# Altium project JEAC605UM-FTTSC-2.0.PRJPCB (part 2 of 3)

## Sheet CPU2.schdoc
size C; SheetNumber: 2; SheetTotal: 8
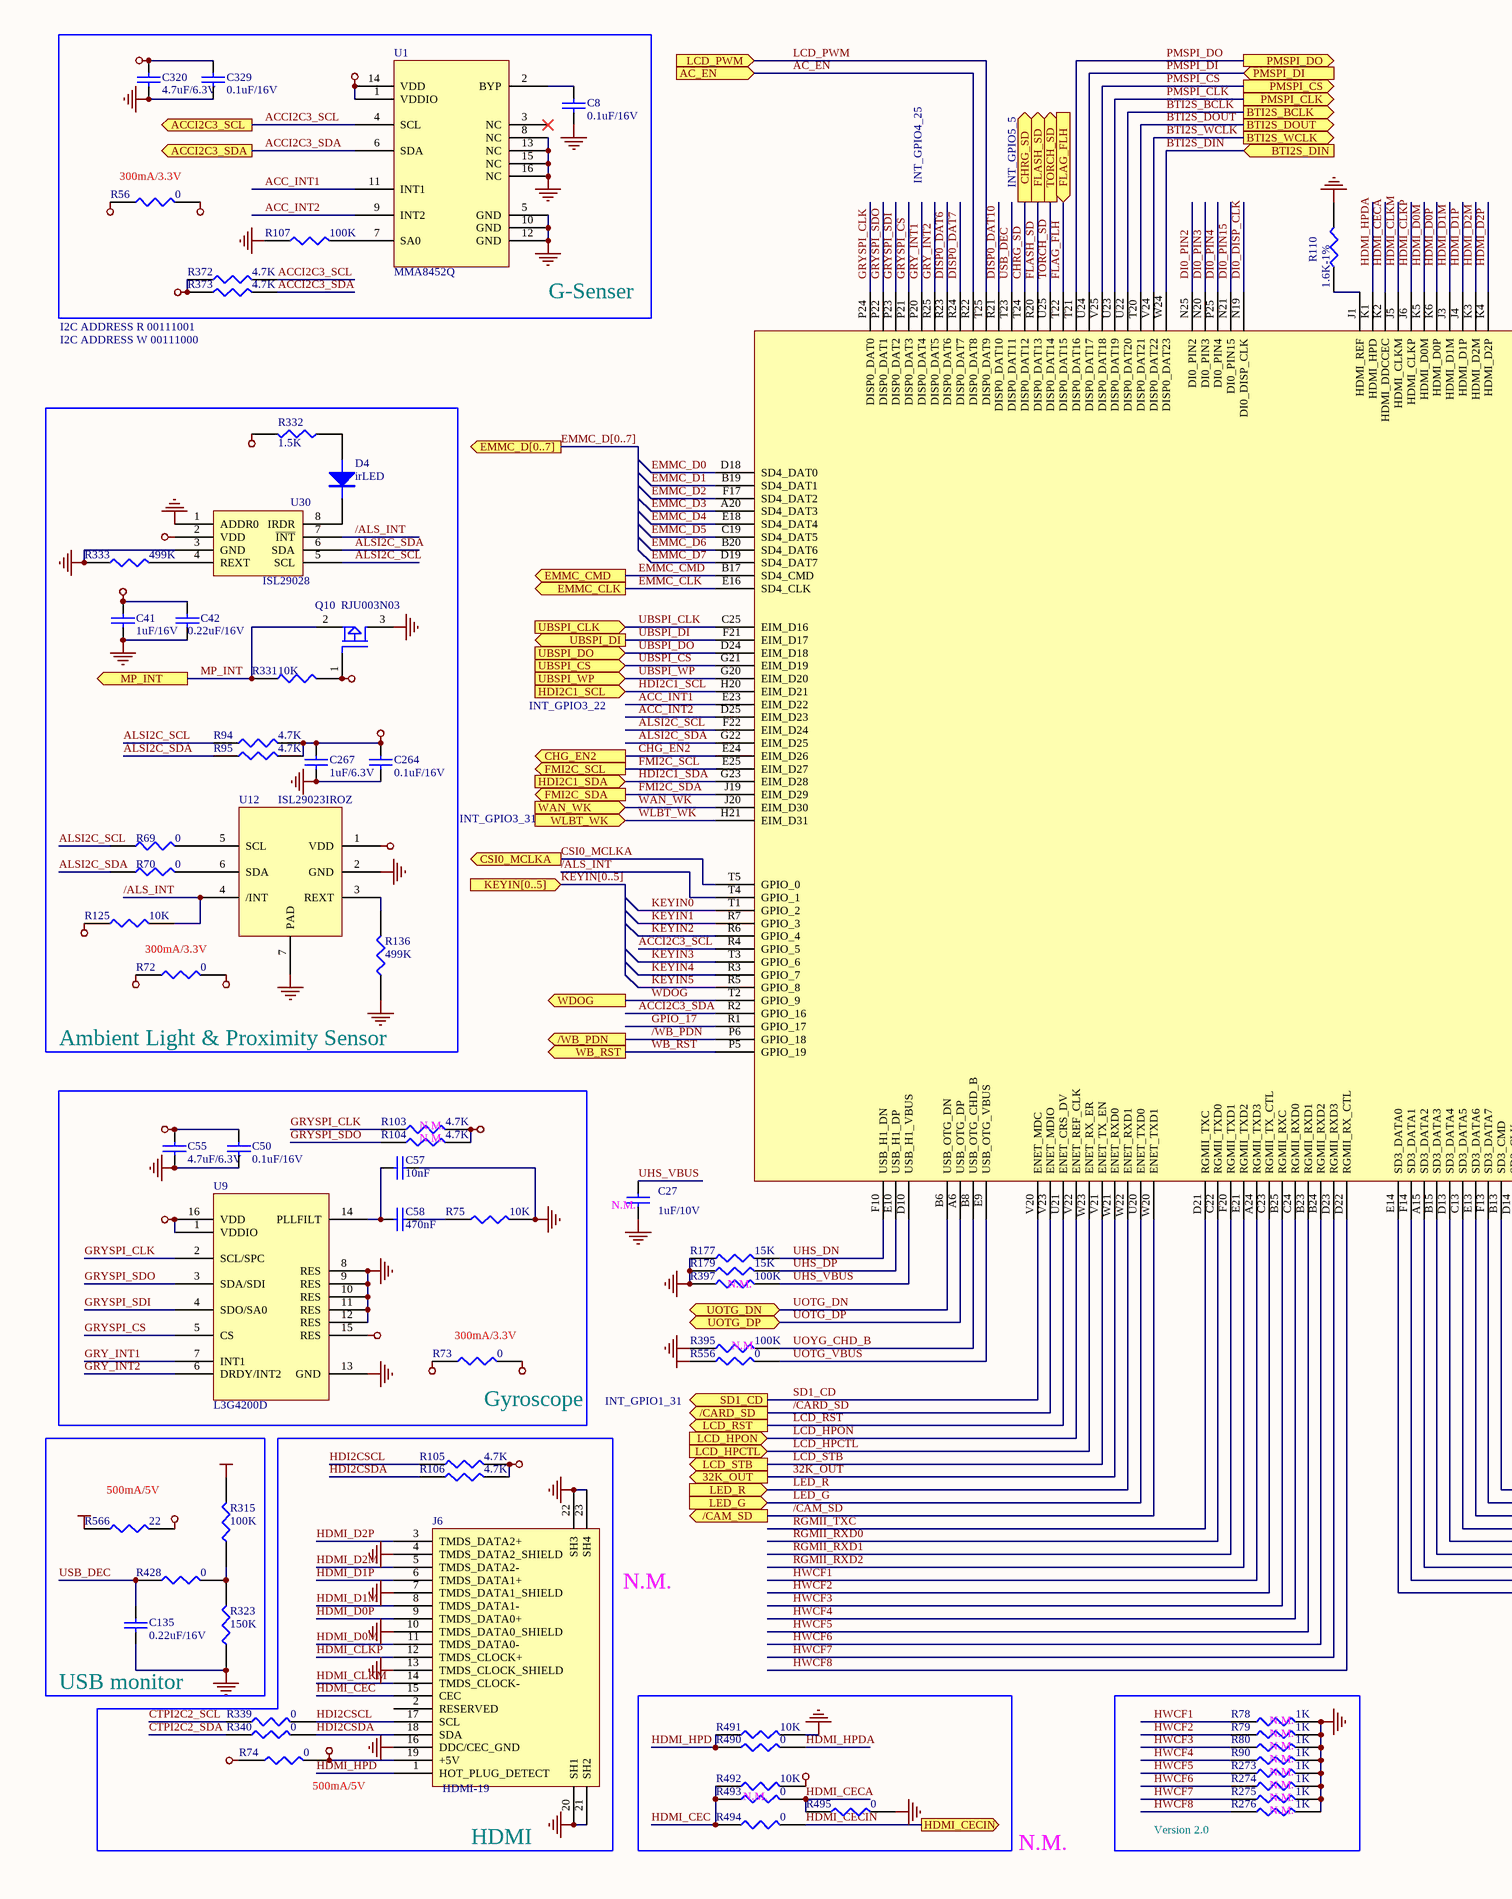
[diagram p7: CPU2.schdoc, left]
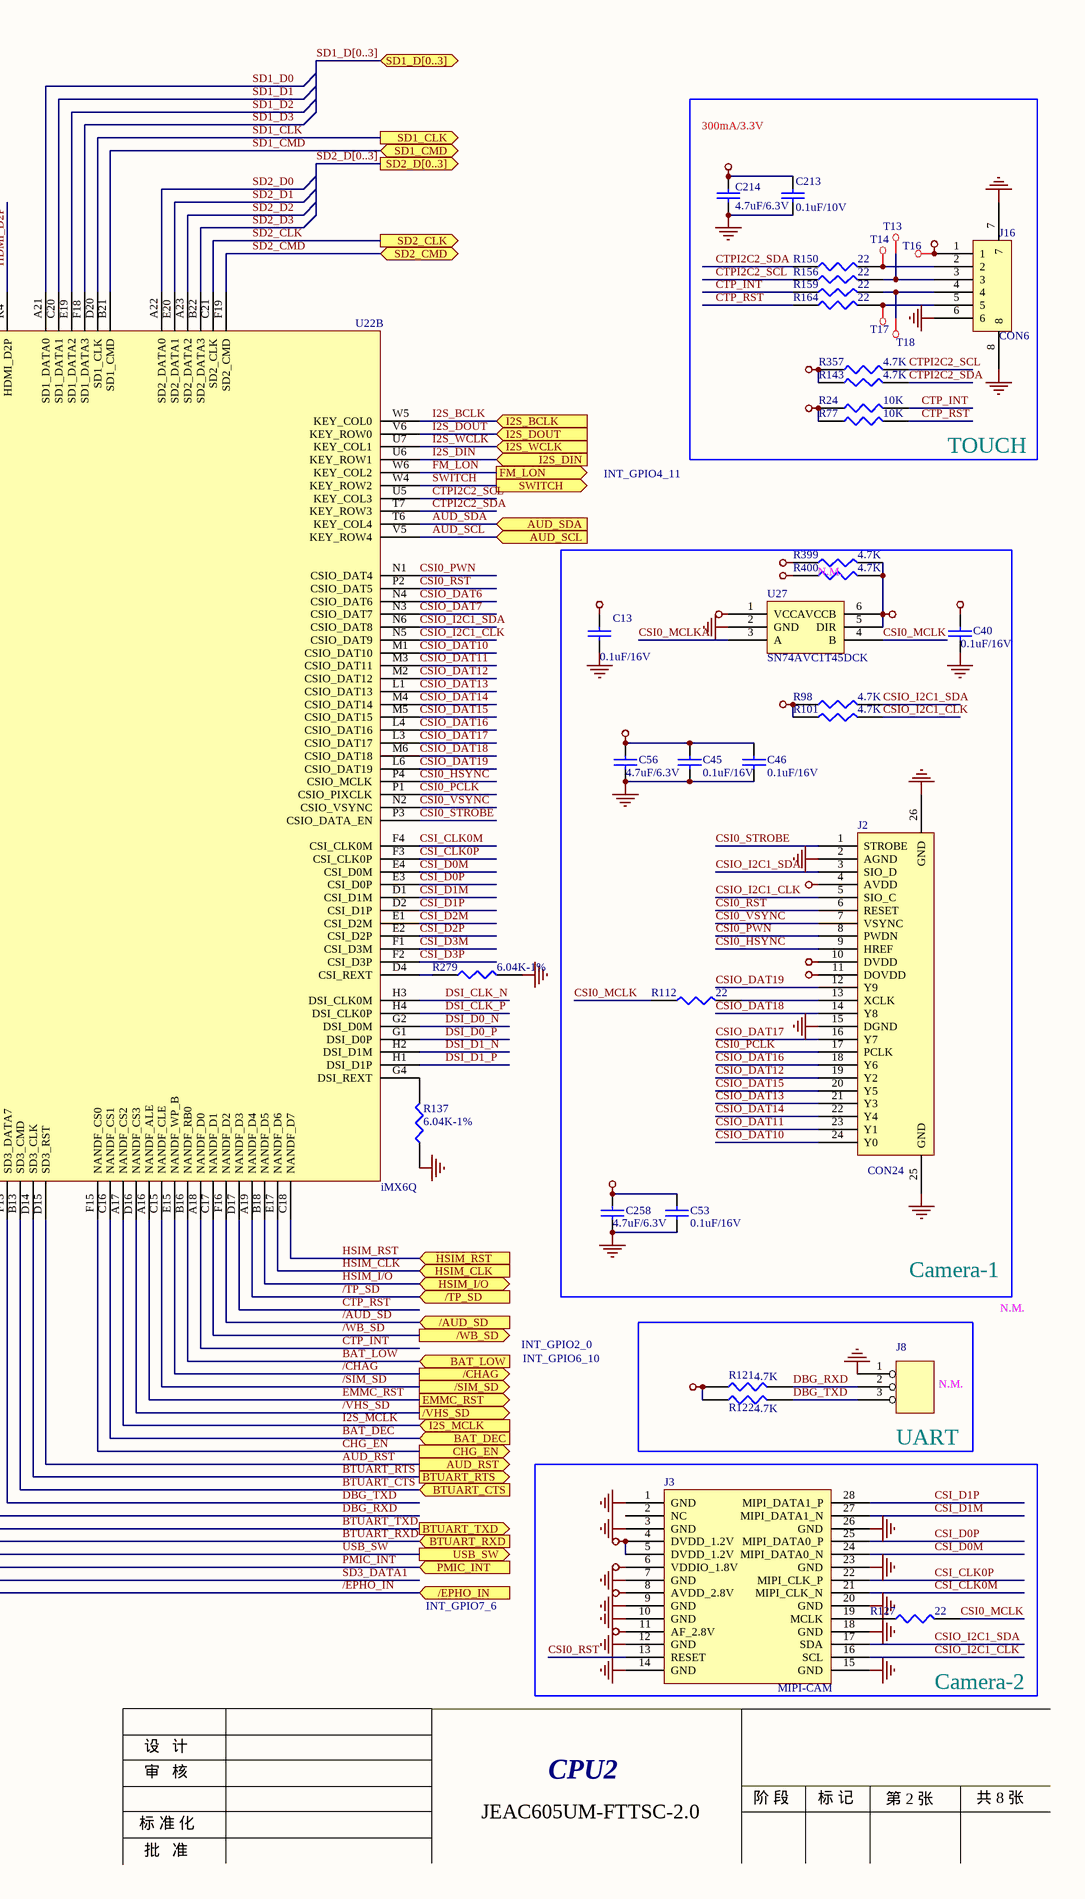
[diagram p8: CPU2.schdoc, right]

### Parts
C8  0.1uF/16V  [C0402]
C13  0.1uF/16V  [C0402]
C27  1uF/10V  [C0603]
C40  0.1uF/16V  [C0402]
C41  1uF/16V  [C0402]
C42  0.22uF/16V  [C0402]
C45  0.1uF/16V  [C0402]
C46  0.1uF/16V  [C0402]
C50  0.1uF/16V  [C0402]
C53  0.1uF/16V  [C0402]
C55  4.7uF/6.3V  [C0603]
C56  4.7uF/6.3V  [C0603]
C57  10nF  [C0402]
C58  470nF  [C0402]
C135  0.22uF/16V  [C0402]
C213  0.1uF/10V  [C0402]
C214  4.7uF/6.3V  [C0603]
C258  4.7uF/6.3V  [C0603]
C264  0.1uF/16V  [C0402]
C267  1uF/6.3V  [C0402]
C320  4.7uF/6.3V  [C0603]
C329  0.1uF/16V  [C0402]
D4  irLED  [R0603]
J2  CON24  [J-CON-24-0_5]
J3  MIPI-CAM  [j-con-GB042-28P-H10-0_4]
J6  HDMI-19  [j-con-19-0_4]
J8  (no value)  [J-CON-3-2_1]
J16  CON6  [J-CON-6-0_5-ATOM]
Q10  RJU003N03  [SOT-23]
R24  10K  [R0402]
R56  0  [R0402]
R69  0  [R0402]
R70  0  [R0402]
R72  0  [R0402]
R73  0  [R0402]
R74  0  [R0603]
R75  10K  [R0402]
R77  10K  [R0402]
R78  1K  [R0402]
R79  1K  [R0402]
R80  1K  [R0402]
R90  1K  [R0402]
R94  4.7K  [R0402]
R95  4.7K  [R0402]
R98  4.7K  [R0402]
R101  4.7K  [R0402]
R103  4.7K  [R0402]
R104  4.7K  [R0402]
R105  4.7K  [R0402]
R106  4.7K  [R0402]
R107  100K  [R0402]
R110  1.6K-1%  [R0402]
R112  22  [R0402]
R121  4.7K  [R0402]
R122  4.7K  [R0402]
R125  10K  [R0402]
R127  22  [R0402]
R136  499K  [R0402]
R137  6.04K-1%  [R0402]
R143  4.7K  [R0402]
R150  22  [R0402]
R156  22  [R0402]
R159  22  [R0402]
R164  22  [R0402]
R177  15K  [R0402]
R179  15K  [R0402]
R273  1K  [R0402]
R274  1K  [R0402]
R275  1K  [R0402]
R276  1K  [R0402]
R279  6.04K-1%  [R0402]
R315  100K  [R0402]
R323  150K  [R0402]
R331  10K  [R0402]
R332  1.5K  [R0402]
R333  499K  [R0402]
R339  0  [R0402]
R340  0  [R0402]
R357  4.7K  [R0402]
R372  4.7K  [R0402]
R373  4.7K  [R0402]
R395  100K  [R0402]
R397  100K  [R0402]
R399  4.7K  [R0402]
R400  4.7K  [R0402]
R428  0  [R0402]
R490  0  [R0402]
R491  10K  [R0402]
R492  10K  [R0402]
R493  0  [R0402]
R494  0  [R0402]
R495  0  [R0402]
R556  0  [R0402]
R566  22  [R0402]
T13  Testpoint  [TP2_0]  (value not drawn)
T14  Testpoint  [TP2_0]  (value not drawn)
T16  Testpoint  [TP2_0]  (value not drawn)
T17  Testpoint  [TP2_0]  (value not drawn)
T18  Testpoint  [TP2_0]  (value not drawn)
U1  MMA8452Q  [U-DFN-16-0_5]
U9  L3G4200D  [U-LGA-16-0_65]
U12  ISL29023IROZ  [U-ODFN-6-0_65]
U22  iMX6Q  [U-BGA-624-0_8]  (part B of 3)
U27  SN74AVC1T45DCK  [SOT-363-6-0_65]
U30  ISL29028  [U-ODFN-8-0_5]

### Blocks framed on the sheet
G-Senser: C8 C320 C329 R56 R107 R372 R373 U1
TOUCH: C213 C214 J16 R24 R77 R143 R150 R156 R159 R164 R357 T13 T14 T16-T18
Ambient Light & Proximity Sensor: C41 C42 C264 C267 D4 Q10 R69 R70 R72 R94 R95 R125 R136 R331-R333 U12 U30
Camera-1: C13 C40 C45 C46 C53 C56 C258 J2 R98 R101 R112 R399 R400 U27
Gyroscope: C50 C55 C57 C58 R73 R75 R103 R104 U9
UART: J8 R121 R122
USB monitor: C135 R315 R323 R428 R566
HDMI: J6 R74 R105 R106 R339 R340
Camera-2: J3 R127
N.M.: R490-R495

### Ports
32K_OUT (out), /AUD_SD (in), /CAM_SD (out), /CARD_SD (out), /CHAG (out), /EPHO_IN (in), /SIM_SD (out), /TP_SD (in), /VHS_SD (out), /WB_PDN (out), /WB_SD (out), AC_EN (in), ACCI2C3_SCL (out), ACCI2C3_SDA (out), AUD_RST (out), AUD_SCL (in), AUD_SDA (in), BAT_DEC (in), BAT_LOW (in), BTI2S_BCLK (out), BTI2S_DIN (in), BTI2S_DOUT (out), BTI2S_WCLK (out), BTUART_CTS (in), BTUART_RTS (out), BTUART_RXD (in), BTUART_TXD (out), CHG_EN2 (out), CHG_EN (out), CHRG_SD (out), CSI0_MCLKA (out), EMMC_CLK (out), EMMC_CMD (out), EMMC_D[0..7] (out), EMMC_RST (out), FLAG_FLH (in), FLASH_SD (out), FM_LON (out), FMI2C_SCL (out), FMI2C_SDA (out), HDI2C1_SCL (in), HDI2C1_SDA (in), HDMI_CECIN (out), HSIM_CLK (in), HSIM_I/O (bidir), HSIM_RST (in), I2S_BCLK (in), I2S_DIN (in), I2S_DOUT (in), I2S_MCLK (in), I2S_WCLK (in), KEYIN[0..5] (in), LCD_HPCTL (in), LCD_HPON (in), LCD_PWM (in), LCD_RST (out), LCD_STB (out), LED_G (in), LED_R (in), MP_INT (out), PMIC_INT (in), PMSPI_CLK (out), PMSPI_CS (out), PMSPI_DI (in), PMSPI_DO (out), SD1_CD (out), SD1_CLK (out), SD1_CMD (bidir), SD1_D[0..3] (bidir), SD2_CLK (out), SD2_CMD (bidir), SD2_D[0..3] (out), SWITCH (out), TORCH_SD (out), UBSPI_CLK (in), UBSPI_CS (in), UBSPI_DI (out), UBSPI_DO (in), UBSPI_WP (in), UOTG_DN (bidir), UOTG_DP (bidir), USB_SW (out), WAN_WK (in), WB_RST (out), WDOG (out), WLBT_WK (in)

### Nets
GND: C8.1 C13.2 C27.2 C40.2 C41.2 C42.2 C45.2 C46.2 C50.1 C53.2 C55.1 C56.1 C57.1 C135.2 C213.2 C214.2 C258.1 C264.1 C267.1 C320.1 C329.1 J2.2(AGND) J2.15(DGND) J2.25(GND) J2.26(GND) J3.1(GND) J3.3(GND) J3.7(GND) J3.9(GND) J3.10(GND) J3.12(GND) J3.14(GND) J3.15(GND) J3.18(GND) J3.20(GND) J3.23(GND) J3.26(GND) J6.4(TMDS_DATA2_SHIELD) J6.7(TMDS_DATA1_SHIELD) J6.10(TMDS_DATA0_SHIELD) J6.13(TMDS_CLOCK_SHIELD) J6.16(DDC/CEC_GND) J6.20(SH1) J6.21(SH2) J6.22(SH3) J6.23(SH4) J8.1 J16.6 J16.7 J16.8 Q10.3(D) R75.2 R78.2 R79.2 R80.2 R90.2 R107.1 R110.2 R136.1 R137.1 R177.1 R179.1 R273.2 R274.2 R275.2 R276.2 R279.2 R323.1 R333.1 R395.1 R397.1 R491.2 R495.2 U1.5(GND) U1.8(NC) U1.10(GND) U1.12(GND) U1.13(NC) U1.15(NC) U1.16(NC) U9.8(RES) U9.9(RES) U9.10(RES) U9.11(RES) U9.12(RES) U9.13(GND) U12.2(GND) U12.7(PAD) U27.2(GND) U30.1(ADDR0) U30.3(GND)
USB_BUSIN: R315.2 R556.1 R566.1
VBUS: R74.1 R566.2
VCC_3V: C13.1 R121.1 R122.1 U27.1(VCCA)
VCC_ACC: C320.2 C329.2 R56.2 R372.1 R373.1 U1.1(VDDIO) U1.14(VDD)
VCC_ALS: C41.1 C42.1 C264.2 C267.2 Q10.1(G) R72.2 R94.2 R95.2 R125.1 R331.2 R332.2 U12.1(VDD) U30.2(VDD)
VCC_CAM: C45.1 C46.1 C56.2 J2.4(AVDD) J2.11(DOVDD) J3.6(VDDIO_1.8V) J3.8(AVDD_2.8V) J3.11(AF_2.8V) R98.1 R101.1
VCC_CAMD: C53.1 C258.2 J2.10(DVDD) J3.4(DVDD_1.2V) J3.5(DVDD_1.2V)
VCC_CSI: R399.1
VCC_GYR: C50.2 C55.2 R73.2 R103.2 R104.2 U9.1(VDDIO) U9.15(RES) U9.16(VDD)
VCC_HD: J6.19(+5V) R74.2 R105.2 R106.2 R492.2
VCC_MCLK: C40.1 R399.2 R400.2 U27.5(DIR) U27.6(VCCB)
VCC_MEMS: R56.1 R72.1 R73.1
VCC_MIPI: R400.1
VCC_TOUCH: C213.1 C214.1 J16.1 R24.1 R77.1 R143.1 R357.1 T16.1(TP)
32K_OUT: U22.W21(ENET_RXD0) ; port 32K_OUT
/ALS_INT: R125.2 U12.4(/INT) U22.T4(GPIO_1) U30.7(~{INT})
/AUD_SD: U22.F16(NANDF_D2) ; port /AUD_SD
/CAM_SD: U22.W20(ENET_TXD1) ; port /CAM_SD
/CARD_SD: U22.V23(ENET_MDIO) ; port /CARD_SD
/CHAG: U22.E15(NANDF_WP_B) ; port /CHAG
/EPHO_IN: U22.E14(SD3_DATA0) ; port /EPHO_IN
/SIM_SD: U22.C15(NANDF_CLE) ; port /SIM_SD
/TP_SD: U22.A19(NANDF_D4) ; port /TP_SD
/VHS_SD: U22.D16(NANDF_CS3) ; port /VHS_SD
/WB_PDN: U22.P6(GPIO_18) ; port /WB_PDN
/WB_SD: U22.C17(NANDF_D1) ; port /WB_SD
AC_EN: U22.R22(DISP0_DAT8) ; port AC_EN
ACC_INT1: U1.11(INT1) U22.E23(EIM_D22)
ACC_INT2: U1.9(INT2) U22.D25(EIM_D23)
ACCI2C3_SCL: R372.2 U1.4(SCL) U22.R4(GPIO_5) ; port ACCI2C3_SCL
ACCI2C3_SDA: R373.2 U1.6(SDA) U22.R2(GPIO_16) ; port ACCI2C3_SDA
ALSI2C_SCL: R69.1 R94.1 U22.F22(EIM_D24) U30.5(SCL)
ALSI2C_SDA: R70.1 R95.1 U22.G22(EIM_D25) U30.6(SDA)
AUD_RST: U22.D15(SD3_RST) ; port AUD_RST
AUD_SCL: U22.V5(KEY_ROW4) ; port AUD_SCL
AUD_SDA: U22.T6(KEY_COL4) ; port AUD_SDA
BAT_DEC: U22.C16(NANDF_CS1) ; port BAT_DEC
BAT_LOW: U22.B16(NANDF_RB0) ; port BAT_LOW
BTI2S_BCLK: U22.U22(DISP0_DAT20) ; port BTI2S_BCLK
BTI2S_DIN: U22.W24(DISP0_DAT23) ; port BTI2S_DIN
BTI2S_DOUT: U22.T20(DISP0_DAT21) ; port BTI2S_DOUT
BTI2S_WCLK: U22.V24(DISP0_DAT22) ; port BTI2S_WCLK
BTUART_CTS: U22.B13(SD3_CMD) ; port BTUART_CTS
BTUART_RTS: U22.D14(SD3_CLK) ; port BTUART_RTS
BTUART_RXD: U22.D13(SD3_DATA4) ; port BTUART_RXD
BTUART_TXD: U22.C13(SD3_DATA5) ; port BTUART_TXD
CHG_EN: U22.F15(NANDF_CS0) ; port CHG_EN
CHG_EN2: U22.E24(EIM_D26) ; port CHG_EN2
CHRG_SD: U22.T24(DISP0_DAT12) ; port CHRG_SD
CSI0_HSYNC: J2.9(HREF) U22.P4(CSIO_MCLK)
CSI0_MCLK: R112.1 R127.2 U27.4(B)
CSI0_MCLKA: U22.T5(GPIO_0) U27.3(A) ; port CSI0_MCLKA
CSI0_PCLK: J2.17(PCLK) U22.P1(CSIO_PIXCLK)
CSI0_PWN: J2.8(PWDN) U22.N1(CSIO_DAT4)
CSI0_RST: J2.6(RESET) J3.13(RESET) U22.P2(CSIO_DAT5)
CSI0_STROBE: J2.1(STROBE) U22.P3(CSIO_DATA_EN)
CSI0_VSYNC: J2.7(VSYNC) U22.N2(CSIO_VSYNC)
CSI_CLK0M: J3.21(MIPI_CLK_N) U22.F4(CSI_CLK0M)
CSI_CLK0P: J3.22(MIPI_CLK_P) U22.F3(CSI_CLK0P)
CSI_D0M: J3.24(MIPI_DATA0_N) U22.E4(CSI_D0M)
CSI_D0P: J3.25(MIPI_DATA0_P) U22.E3(CSI_D0P)
CSI_D1M: J3.27(MIPI_DATA1_N) U22.D1(CSI_D1M)
CSI_D1P: J3.28(MIPI_DATA1_P) U22.D2(CSI_D1P)
CSI_D2M: U22.E1(CSI_D2M)
CSI_D2P: U22.E2(CSI_D2P)
CSI_D3M: U22.F1(CSI_D3M)
CSI_D3P: U22.F2(CSI_D3P)
CSIO_DAT6: U22.N4(CSIO_DAT6)
CSIO_DAT7: U22.N3(CSIO_DAT7)
CSIO_DAT10: J2.24(Y0) U22.M1(CSIO_DAT10)
CSIO_DAT11: J2.23(Y1) U22.M3(CSIO_DAT11)
CSIO_DAT12: J2.19(Y2) U22.M2(CSIO_DAT12)
CSIO_DAT13: J2.21(Y3) U22.L1(CSIO_DAT13)
CSIO_DAT14: J2.22(Y4) U22.M4(CSIO_DAT14)
CSIO_DAT15: J2.20(Y5) U22.M5(CSIO_DAT15)
CSIO_DAT16: J2.18(Y6) U22.L4(CSIO_DAT16)
CSIO_DAT17: J2.16(Y7) U22.L3(CSIO_DAT17)
CSIO_DAT18: J2.14(Y8) U22.M6(CSIO_DAT18)
CSIO_DAT19: J2.12(Y9) U22.L6(CSIO_DAT19)
CSIO_I2C1_CLK: J2.5(SIO_C) J3.16(SCL) R101.2 U22.N5(CSIO_DAT9)
CSIO_I2C1_SDA: J2.3(SIO_D) J3.17(SDA) R98.2 U22.N6(CSIO_DAT8)
CTP_INT: R24.2 R159.1 U22.A18(NANDF_D0)
CTP_RST: R77.2 R164.1 U22.D17(NANDF_D3)
CTPI2C2_SCL: R156.1 R339.1 R357.2 U22.U5(KEY_COL3)
CTPI2C2_SDA: R143.2 R150.1 R340.1 U22.T7(KEY_ROW3)
DBG_RXD: J8.2 R121.2 U22.E13(SD3_DATA6)
DBG_TXD: J8.3 R122.2 U22.F13(SD3_DATA7)
DI0_DISP_CLK: U22.N19(DI0_DISP_CLK)
DI0_PIN2: U22.N25(DI0_PIN2)
DI0_PIN3: U22.N20(DI0_PIN3)
DI0_PIN4: U22.P25(DI0_PIN4)
DI0_PIN15: U22.N21(DI0_PIN15)
DISP0_DAT6: U22.R23(DISP0_DAT6)
DISP0_DAT7: U22.R24(DISP0_DAT7)
DISP0_DAT10: U22.R21(DISP0_DAT10)
DSI_CLK_N: U22.H3(DSI_CLK0M)
DSI_CLK_P: U22.H4(DSI_CLK0P)
DSI_D0_N: U22.G2(DSI_D0M)
DSI_D0_P: U22.G1(DSI_D0P)
DSI_D1_N: U22.H2(DSI_D1M)
DSI_D1_P: U22.H1(DSI_D1P)
EMMC_CLK: U22.E16(SD4_CLK) ; port EMMC_CLK
EMMC_CMD: U22.B17(SD4_CMD) ; port EMMC_CMD
EMMC_D0: U22.D18(SD4_DAT0)
EMMC_D1: U22.B19(SD4_DAT1)
EMMC_D2: U22.F17(SD4_DAT2)
EMMC_D3: U22.A20(SD4_DAT3)
EMMC_D4: U22.E18(SD4_DAT4)
EMMC_D5: U22.C19(SD4_DAT5)
EMMC_D6: U22.B20(SD4_DAT6)
EMMC_D7: U22.D19(SD4_DAT7)
EMMC_RST: U22.A16(NANDF_ALE) ; port EMMC_RST
FLAG_FLH: U22.T22(DISP0_DAT15) ; port FLAG_FLH
FLASH_SD: U22.R20(DISP0_DAT13) ; port FLASH_SD
FM_LON: U22.W6(KEY_COL2) ; port FM_LON
FMI2C_SCL: U22.E25(EIM_D27) ; port FMI2C_SCL
FMI2C_SDA: U22.J19(EIM_D29) ; port FMI2C_SDA
GPIO_17: U22.R1(GPIO_17)
GRY_INT1: U9.7(INT1) U22.P20(DISP0_DAT4)
GRY_INT2: U9.6(DRDY/INT2) U22.R25(DISP0_DAT5)
GRYSPI_CLK: R103.1 U9.2(SCL/SPC) U22.P24(DISP0_DAT0)
GRYSPI_CS: U9.5(CS) U22.P21(DISP0_DAT3)
GRYSPI_SDI: U9.4(SDO/SA0) U22.P23(DISP0_DAT2)
GRYSPI_SDO: R104.1 U9.3(SDA/SDI) U22.P22(DISP0_DAT1)
HDI2C1_SCL: U22.H20(EIM_D21) ; port HDI2C1_SCL
HDI2C1_SDA: U22.G23(EIM_D28) ; port HDI2C1_SDA
HDI2CSCL: J6.17(SCL) R105.1 R339.2
HDI2CSDA: J6.18(SDA) R106.1 R340.2
HDMI_CEC: J6.15(CEC) R492.1 R493.1 R494.1
HDMI_CECA: R493.2 R495.1 U22.K2(HDMI_DDCCEC)
HDMI_CECIN: R494.2 ; port HDMI_CECIN
HDMI_CLKM: J6.14(TMDS_CLOCK-) U22.J5(HDMI_CLKM)
HDMI_CLKP: J6.12(TMDS_CLOCK+) U22.J6(HDMI_CLKP)
HDMI_D0M: J6.11(TMDS_DATA0-) U22.K5(HDMI_D0M)
HDMI_D0P: J6.9(TMDS_DATA0+) U22.K6(HDMI_D0P)
HDMI_D1M: J6.8(TMDS_DATA1-) U22.J3(HDMI_D1M)
HDMI_D1P: J6.6(TMDS_DATA1+) U22.J4(HDMI_D1P)
HDMI_D2M: J6.5(TMDS_DATA2-) U22.K3(HDMI_D2M)
HDMI_D2P: J6.3(TMDS_DATA2+) U22.K4(HDMI_D2P)
HDMI_HPD: J6.1(HOT_PLUG_DETECT) R490.1 R491.1
HDMI_HPDA: R490.2 U22.K1(HDMI_HPD)
HSIM_CLK: U22.E17(NANDF_D6) ; port HSIM_CLK
HSIM_I/O: U22.B18(NANDF_D5) ; port HSIM_I/O
HSIM_RST: U22.C18(NANDF_D7) ; port HSIM_RST
HWCF1: R78.1 U22.A24(RGMII_TXD3)
HWCF2: R79.1 U22.C23(RGMII_TX_CTL)
HWCF3: R80.1 U22.B25(RGMII_RXC)
HWCF4: R90.1 U22.C24(RGMII_RXD0)
HWCF5: R273.1 U22.B23(RGMII_RXD1)
HWCF6: R274.1 U22.B24(RGMII_RXD2)
HWCF7: R275.1 U22.D23(RGMII_RXD3)
HWCF8: R276.1 U22.D22(RGMII_RX_CTL)
I2S_BCLK: U22.W5(KEY_COL0) ; port I2S_BCLK
I2S_DIN: U22.U6(KEY_ROW1) ; port I2S_DIN
I2S_DOUT: U22.V6(KEY_ROW0) ; port I2S_DOUT
I2S_MCLK: U22.A17(NANDF_CS2) ; port I2S_MCLK
I2S_WCLK: U22.U7(KEY_COL1) ; port I2S_WCLK
KEYIN0: U22.T1(GPIO_2)
KEYIN1: U22.R7(GPIO_3)
KEYIN2: U22.R6(GPIO_4)
KEYIN3: U22.T3(GPIO_6)
KEYIN4: U22.R3(GPIO_7)
KEYIN5: U22.R5(GPIO_8)
LCD_HPCTL: U22.W23(ENET_RX_ER) ; port LCD_HPCTL
LCD_HPON: U22.V22(ENET_REF_CLK) ; port LCD_HPON
LCD_PWM: U22.T25(DISP0_DAT9) ; port LCD_PWM
LCD_RST: U22.U21(ENET_CRS_DV) ; port LCD_RST
LCD_STB: U22.V21(ENET_TX_EN) ; port LCD_STB
LED_G: U22.U20(ENET_TXD0) ; port LED_G
LED_R: U22.W22(ENET_RXD1) ; port LED_R
MP_INT: Q10.2(S) R331.1 ; port MP_INT
PMIC_INT: U22.A15(SD3_DATA2) ; port PMIC_INT
PMSPI_CLK: U22.U23(DISP0_DAT19) ; port PMSPI_CLK
PMSPI_CS: U22.V25(DISP0_DAT18) ; port PMSPI_CS
PMSPI_DI: U22.U24(DISP0_DAT17) ; port PMSPI_DI
PMSPI_DO: U22.T21(DISP0_DAT16) ; port PMSPI_DO
RGMII_RXD0: U22.C22(RGMII_TXD0)
RGMII_RXD1: U22.F20(RGMII_TXD1)
RGMII_RXD2: U22.E21(RGMII_TXD2)
RGMII_TXC: U22.D21(RGMII_TXC)
SD1_CD: U22.V20(ENET_MDC) ; port SD1_CD
SD1_CLK: U22.D20(SD1_CLK) ; port SD1_CLK
SD1_CMD: U22.B21(SD1_CMD) ; port SD1_CMD
SD1_D0: U22.A21(SD1_DATA0)
SD1_D1: U22.C20(SD1_DATA1)
SD1_D2: U22.E19(SD1_DATA2)
SD1_D3: U22.F18(SD1_DATA3)
SD2_CLK: U22.C21(SD2_CLK) ; port SD2_CLK
SD2_CMD: U22.F19(SD2_CMD) ; port SD2_CMD
SD2_D0: U22.A22(SD2_DATA0)
SD2_D1: U22.E20(SD2_DATA1)
SD2_D2: U22.A23(SD2_DATA2)
SD2_D3: U22.B22(SD2_DATA3)
SD3_DATA1: U22.F14(SD3_DATA1)
SWITCH: U22.W4(KEY_ROW2) ; port SWITCH
TORCH_SD: U22.U25(DISP0_DAT14) ; port TORCH_SD
UBSPI_CLK: U22.C25(EIM_D16) ; port UBSPI_CLK
UBSPI_CS: U22.G21(EIM_D19) ; port UBSPI_CS
UBSPI_DI: U22.F21(EIM_D17) ; port UBSPI_DI
UBSPI_DO: U22.D24(EIM_D18) ; port UBSPI_DO
UBSPI_WP: U22.G20(EIM_D20) ; port UBSPI_WP
UHS_DN: R177.2 U22.F10(USB_H1_DN)
UHS_DP: R179.2 U22.E10(USB_H1_DP)
UHS_VBUS: C27.1 R397.2 U22.D10(USB_H1_VBUS)
UOTG_DN: U22.B6(USB_OTG_DN) ; port UOTG_DN
UOTG_DP: U22.A6(USB_OTG_DP) ; port UOTG_DP
UOTG_VBUS: R556.2 U22.E9(USB_OTG_VBUS)
UOYG_CHD_B: R395.2 U22.B8(USB_OTG_CHD_B)
USB_DEC: C135.1 R428.1 U22.T23(DISP0_DAT11)
USB_SW: U22.B15(SD3_DATA3) ; port USB_SW
WAN_WK: U22.J20(EIM_D30) ; port WAN_WK
WB_RST: U22.P5(GPIO_19) ; port WB_RST
WDOG: U22.T2(GPIO_9) ; port WDOG
WLBT_WK: U22.H21(EIM_D31) ; port WLBT_WK
NetC8_2: C8.2 U1.2(BYP)
NetC57_2: C57.2 C58.2 U9.14(PLLFILT)
NetC58_1: C58.1 R75.1
NetD4_1: D4.1 R332.1
NetD4_2: D4.2 U30.8(IRDR)
NetJ2_13: J2.13(XCLK) R112.2
NetJ3_19: J3.19(MCLK) R127.1
NetJ16_2: J16.2 R150.2 T14.1(TP)
NetJ16_3: J16.3 R156.2 T13.1(TP)
NetJ16_4: J16.4 R159.2 T18.1(TP)
NetJ16_5: J16.5 R164.2 T17.1(TP)
NetR69_2: R69.2 U12.5(SCL)
NetR70_2: R70.2 U12.6(SDA)
NetR107_2: R107.2 U1.7(SA0)
NetR110_1: R110.1 U22.J1(HDMI_REF)
NetR136_2: R136.2 U12.3(REXT)
NetR137_2: R137.2 U22.G4(DSI_REXT)
NetR279_1: R279.1 U22.D4(CSI_REXT)
NetR315_1: R315.1 R323.2 R428.2
NetR333_2: R333.2 U30.4(REXT)

Not connected (* = marked no-connect by the designer): J3 2(NC); J6 2(RESERVED); U1 3(NC)*

### Buses and harness runs
bus EMMC_D[0..7] = port EMMC_D[0..7]
bus KEYIN[0..5] = port KEYIN[0..5]
bus SD1_D[0..3] = port SD1_D[0..3]
bus SD2_D[0..3] = port SD2_D[0..3]

### Notes on the sheet
- (near R56) 300mA/3.3V
- INT_GPIO4_25
- INT_GPIO5_5
- 300mA/3.3V
- I2C ADDRESS R 00111001
- I2C ADDRESS W 00111000
- INT_GPIO4_11
- N.M.
- INT_GPIO3_22
- INT_GPIO3_31
- (near R103) N.M.
- (near C27) N.M.
- (near R73) 300mA/3.3V
- (near R397) N.M.
- (near R395) N.M.
- INT_GPIO2_0
- INT_GPIO1_31
- INT_GPIO6_10
- (near J8) N.M.
- (near R566) 500mA/5V
- (near J6) N.M.
- INT_GPIO7_6
- (near R78) N.M.
- (near R74) 500mA/5V
- (near R90) N.M.
- (near R80) N.M.
- (near R79) N.M.
- (near R275) N.M.
- (near R274) N.M.
- (near R273) N.M.
- 设   计
- 审   核
- CPU2
- Version 2.0
- (near R276) N.M.
- 标 准 化
- 批   准
- JEAC605UM-FTTSC-2.0
- 阶 段
- 标 记
- 第 2 张
- 共 8 张

### Library data of the parts
C8 C50 C55 C57 C58 C264 C267 C320 C329 = CAP
C13 C27 C40-C42 C45 C46 C53 C56 C135 C213 C214 C258 = CAP: Capacitor
D4 = DIODE
J2 = CON-24
J3 = MIPI-28
J8 = 3 HEADER
Q10 = SI1021
R24 R56 R69 R70 R72-R75 R77-R80 R90 R94 R95 R98 R101 R103-R107 R110 R112 R121 R122 R125 R127 R136 R137 R143 R150 R156 R159 R164 R177 R179 R273-R276 R279 R315 R323 R331-R333 R339 R340 R357 R372 R373 R395 R397 R399 R400 R428 R490-R495 R556 R566 = RES1
U22 = IMX6Q: pin to pad: A4>132 A5>U12 A8>133 A12>A10 A13>130 A14>A12 A15>F17 A16>83 A17>85 A19>91 A25>131 AA7>139 AA16>136 AA22>138 AA23>72 AA24>Y23 AA25>Y22 AB3>141 AB24>140 AB25>67 AC24>62 AC25>66 AD1>G23 AD2>H20 AD3>H22 AD4>147 AD5>E21 AD6>D23 AD7>148 AD8>T22 AD9>V23 AD10>142 AD11>AA22 AD12>L20 AD13>143 AD14>P22 AD15>K23 AD16>144 AD17>P19 AD18>H23 AD19>145 AD20>D23 AD21>54 AD22>146 AD23>T22 AD24>77 AD25>65 AE1>149 AE2>G21 AE3>H23 AE4>G22 AE5>D21 AE6>D22 AE7>D20 AE8>T23 AE9>Y20 AE10>W20 AE11>Y21 AE12>M21 AE13>N21 AE14>P23 AE15>K22 AE16>L18 AE17>M23 AE18>H22 AE19>46 AE20>D22 AE21>57 AE22>60 AE23>T23 AE24>61 AE25>150 B4>151 B5>170 B12>B10 B14>B12 B15>F16 B16>86 C1>152 C2>E15 C3>A8 C4>154 C6>155 C8>F9 C10>153 C13>C20 C15>84 C16>84 C17>88 C18>94 C25>U6 D3>156 D6>157 D8>158 D13>A21 D14>E16 D16>86 D17>90 D24>V1 D25>Y1 E5>159 E6>160 E7>161 E8>215 E13>E19 E14>A20 E15>85 E17>93 E20>C14 E22>Y3 E23>W2 E24>V5 E25>V4 F5>162 F6>163 F7>164 F15>83 F16>89 F23>Y4 F24>AA3 F25>Y5 G3>168 G5>C16 G6>W23 G10>166 G11>279 G14>H14 G15>209 G17>237 G19>167 G20>W1 G21>V2 G22>W3 G23>AA1 G24>V7 G25>W7 H5>73 H6>70 H8>172 H9>277 H10>296 H11>259 H12>169 H13>244 H16>267 H17>287 H18>171 H19>W6 H20>V3 H21>W5 H22>P18 H23>AA4 H24>W8 H25>G20 J4>D14 J5>F18 J7>298 J8>177 J9>278 J10>297 J11>260 J12>173 J13>245 J14>238 J15>174 J16>268 J17>288 J18>175 J19>AA2 J21>V6 J22>AB3 J23>Y7 J24>V8 J25>J21 K7>D13 K8>182 K9>251 K10>178 K11>261 K12>179 K13>246 K14>239 K15>180 K16>269 K17>289 K18>181 K19>258 K20>AB4 K22>AA6 K23>AB5 K24>W9 K25>R21 L7>M7 L8>189 L9>252 L10>183 L11>262 L13>247 L14>240 L15>185 L16>270 L17>290 L18>186 L19>U9 L20>R22 L21>AA7 L22>F23 L23>V9 L24>T21 L25>C23 M8>194 M9>253 M10>190 M11>263 M12>191 M13>248 M14>241 M15>192 M16>271 M17>291 M18>193 M19>U9 M20>E20 M21>W10 M22>U20 M23>C22 M24>V10 M25>AB9 N7>B19 N8>198 N9>254 N10>195 N11>264 N12>294 N13>249 N14>242 N15>196 N16>272 N17>292 N18>197 N19>R2 N20>C2 N21>E4 N22>W11 N23>W21 N24>R23 N25>D3 P7>165 P8>203 P9>255 P10>199 P11>265 P12>200 P13>250 P14>243 P15>201 P16>273 P17>293 P18>202 P19>J7 P20>R6 P22>J4 P23>N4 P24>J5 P25>D2 R1>A3 R2>C6 R3>A4 R4>A5 R5>B5 R6>D8 R8>207 R9>256 R10>280 R11>266 R12>204 R13>250 R14>243 R15>205 R16>274 R17>206 R18>28 R19>E7 R21>G3 R22>G6 R23>R3 R24>H6 R25>R1 T1>B21 T2>E8 T3>A19 T4>W22 T5>C8 T6>E5 T8>213 T9>257 T10>281 T11>208 T13>282 T14>283 T15>210 T16>275 T17>211 T18>29 T19>212 T20>C1 T21>D1 T22>F3 T23>H5 T24>N3 T25>E2 U5>F6 U6>D6 U8>218 U10>284 U13>285 U14>286 U15>216 U18>30 U19>219 U20>D17 U21>K20 U22>F4 U23>G5 U24>F5 U25>F2 V5>E6 V6>B3 V8>220 V9>40 V10>31 V11>32 V12>33 V13>34 V14>35 V15>36 V16>37 V17>38 V18>39 V19>221 V23>A21 V24>E3 V25>U1 W3>222 W4>D18 W5>B21 W6>C4 W7>223 W8>224 W9>225 W10>226 W11>227 W15>230 W16>231 W17>232 W18>233 W19>234 W20>B17 W21>D15 W22>C19 W23>F12 W24>C3 W25>74 Y5>235 Y20>55 Y21>78 Y24>236 Y25>69
U27 = Component_1

## Sheet OTHER.schdoc
size C; SheetNumber: 7; SheetTotal: 8
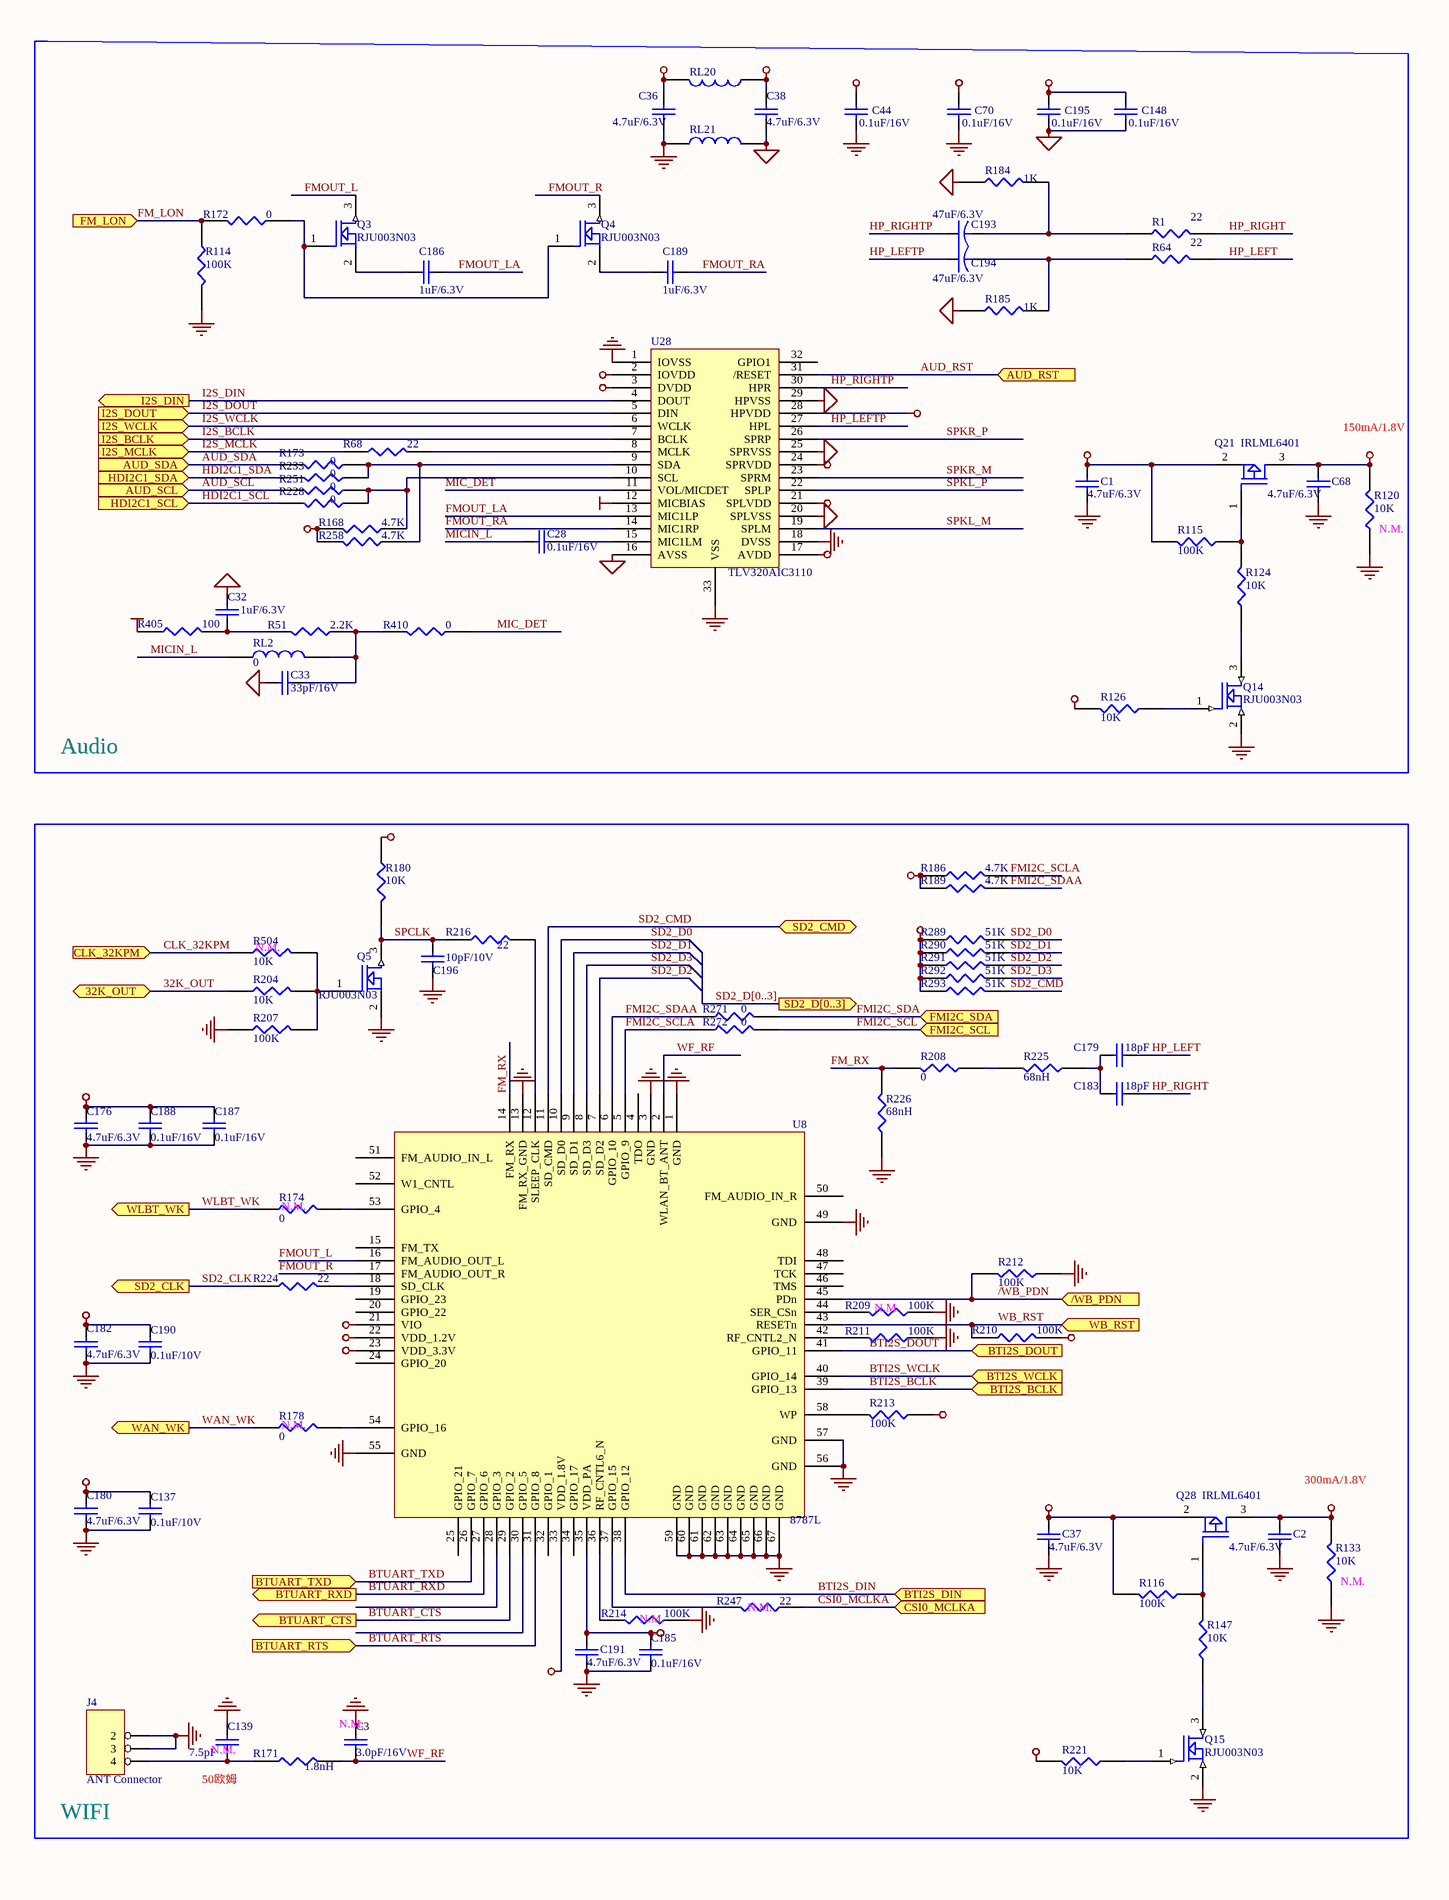
[diagram p9: OTHER.schdoc, left]
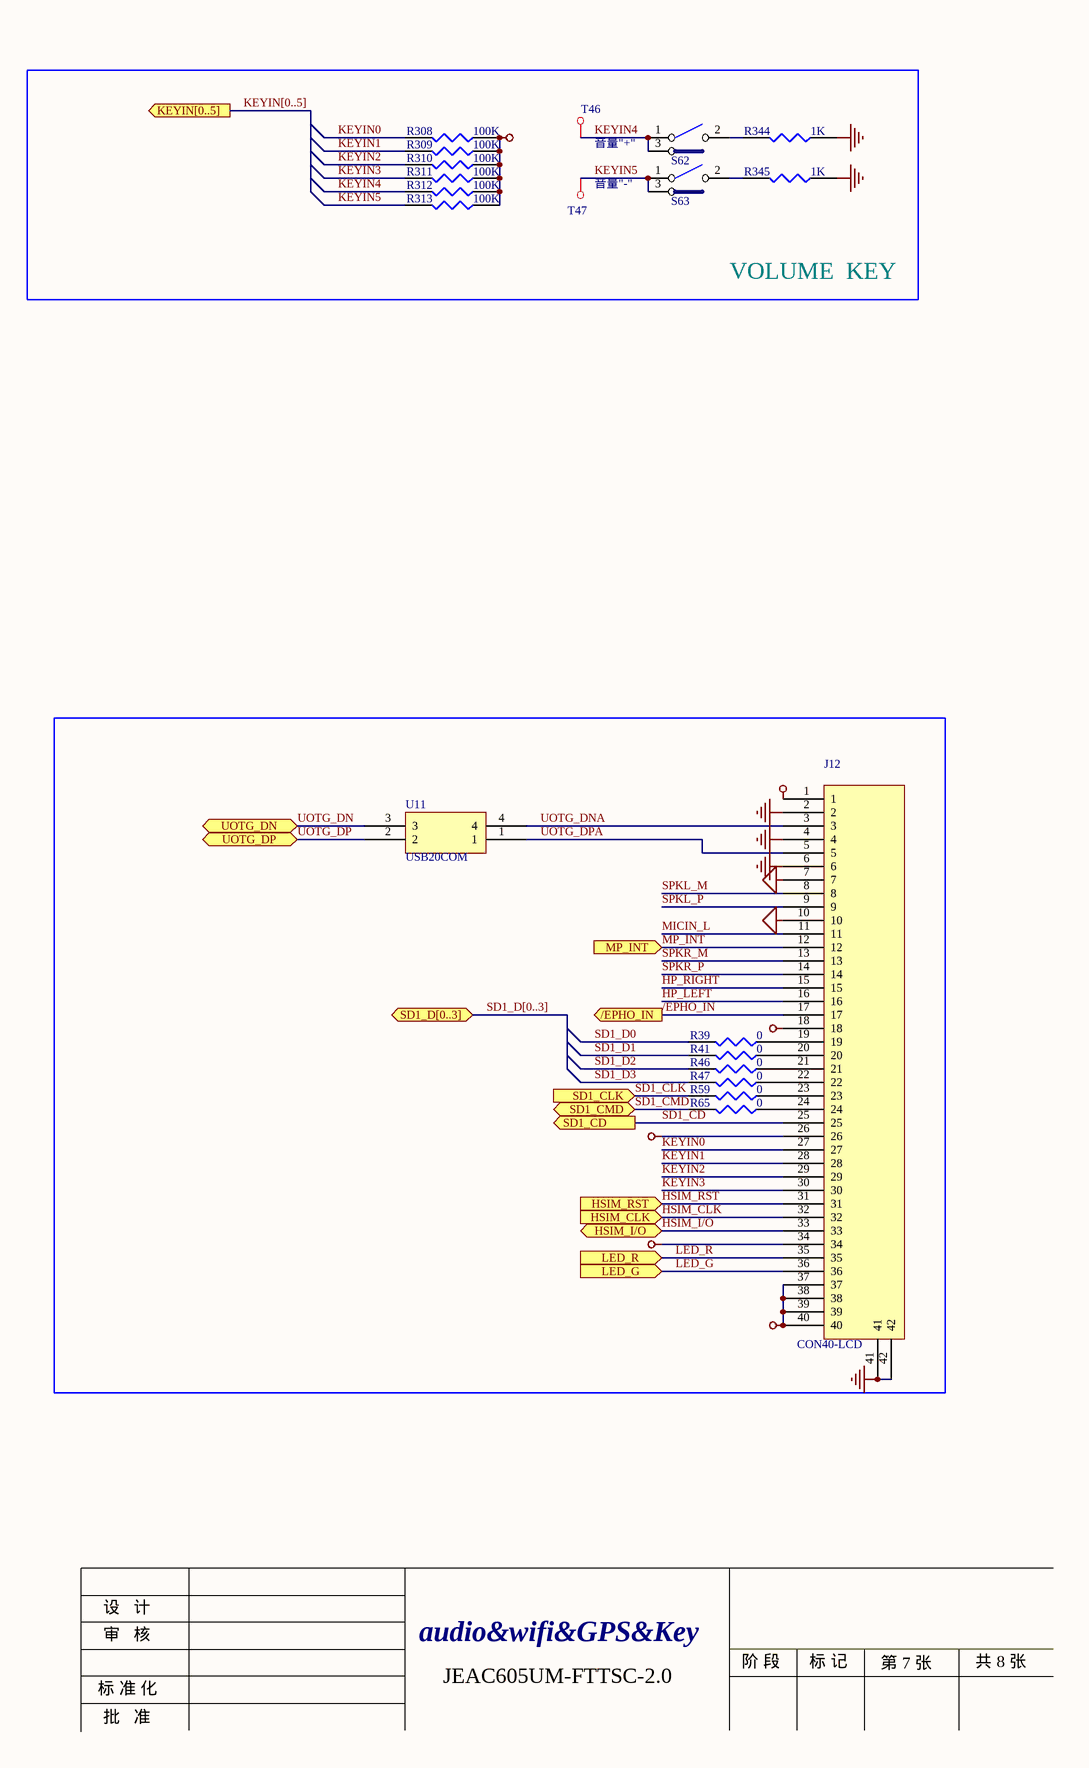
[diagram p10: OTHER.schdoc, right]

### Parts
C1  4.7uF/6.3V  [C0603]
C2  4.7uF/6.3V  [C0603]
C3  3.0pF/16V  [C0402]
C28  0.1uF/16V  [C0402]
C32  1uF/6.3V  [C0402]
C33  33pF/16V  [C0402]
C36  4.7uF/6.3V  [C0603]
C37  4.7uF/6.3V  [C0603]
C38  4.7uF/6.3V  [C0603]
C44  0.1uF/16V  [C0402]
C68  4.7uF/6.3V  [C0603]
C70  0.1uF/16V  [C0402]
C137  0.1uF/10V  [C0402]
C139  7.5pF  [C0402]
C148  0.1uF/16V  [C0402]
C176  4.7uF/6.3V  [C0603]
C179  18pF  [C0402]
C180  4.7uF/6.3V  [C0603]
C182  4.7uF/6.3V  [C0603]
C183  18pF  [C0402]
C185  0.1uF/16V  [C0402]
C186  1uF/6.3V  [C0402]
C187  0.1uF/16V  [C0402]
C188  0.1uF/16V  [C0402]
C189  1uF/6.3V  [C0402]
C190  0.1uF/10V  [C0402]
C191  4.7uF/6.3V  [C0603]
C193  47uF/6.3V  [C1206B1]
C194  47uF/6.3V  [C1206B1]
C195  0.1uF/16V  [C0402]
C196  10pF/10V  [C0402]
J4  ANT Connector  [J-AT-3-50-H]
J12  CON40-LCD  [j-con-40-0_5]
Q3  RJU003N03  [SOT-23-NPN]
Q4  RJU003N03  [SOT-23-NPN]
Q5  RJU003N03  [SOT-23-NPN]
Q14  RJU003N03  [SOT-23-NPN]
Q15  RJU003N03  [SOT-23-NPN]
Q21  IRLML6401  [SOT-23]
Q28  IRLML6401  [SOT-23]
R1  22  [R0402]
R39  0  [R0402]
R41  0  [R0402]
R46  0  [R0402]
R47  0  [R0402]
R51  2.2K  [R0402]
R59  0  [R0402]
R64  22  [R0402]
R65  0  [R0402]
R68  22  [R0402]
R114  100K  [R0402]
R115  100K  [R0402]
R116  100K  [R0402]
R120  10K  [R0402]
R124  10K  [R0402]
R126  10K  [R0402]
R133  10K  [R0402]
R147  10K  [R0402]
R168  4.7K  [R0402]
R171  1.8nH  [R0402]
R172  0  [R0402]
R173  0  [R0402]
R174  0  [R0402]
R178  0  [R0402]
R180  10K  [R0402]
R184  1K  [R0402]
R185  1K  [R0402]
R186  4.7K  [R0402]
R189  4.7K  [R0402]
R204  10K  [R0402]
R207  100K  [R0402]
R208  0  [R0402]
R209  100K  [R0402]
R210  100K  [R0402]
R211  100K  [R0402]
R212  100K  [R0402]
R213  100K  [R0402]
R214  100K  [R0402]
R216  22  [R0402]
R221  10K  [R0402]
R224  22  [R0402]
R225  68nH  [R0402]
R226  68nH  [R0402]
R228  0  [R0402]
R233  0  [R0402]
R247  22  [R0402]
R251  0  [R0402]
R258  4.7K  [R0402]
R271  0  [R0402]
R272  0  [R0402]
R289  51K  [R0402]
R290  51K  [R0402]
R291  51K  [R0402]
R292  51K  [R0402]
R293  51K  [R0402]
R308  100K  [R0402]
R309  100K  [R0402]
R310  100K  [R0402]
R311  100K  [R0402]
R312  100K  [R0402]
R313  100K  [R0402]
R344  1K  [R0402]
R345  1K  [R0402]
R405  100  [R0402]
R410  0  [R0402]
R504  10K  [R0402]
RL2  0  [L0402]
RL20  (no value)  [L0603]
RL21  (no value)  [L0603]
S62  SW SPST_side  [J-SW-3-1_225]  (value not drawn)
S63  SW SPST_side  [J-SW-3-1_225]  (value not drawn)
T46  Testpoint  [TP2_0]  (value not drawn)
T47  Testpoint  [TP2_0]  (value not drawn)
U8  8787L  [U-WM-67-0_605]
U11  USB20COM  [F-CHOKE-4-0805]
U28  TLV320AIC3110  [U-QFN-32-0_5]

### Blocks framed on the sheet
Audio: C1 C28 C32 C33 C36 C38 C44 C68 C70 C148 C186 C189 C193-C195 Q3 Q4 Q14 Q21 R1 R51 R64 R68 R114 R115 R120 R124 R126 R168 R172 R173 R184 R185 R228 R233 R251 R258 R405 R410 RL2 RL20 RL21 U28
VOLUME  KEY: R308-R313 R344 R345 S62 S63 T46 T47
WIFI: C2 C3 C37 C137 C139 C176 C179 C180 C182 C183 C185 C187 C188 C190 C191 C196 J4 Q5 Q15 Q28 R116 R133 R147 R171 R174 R178 R180 R186 R189 R204 R207-R214 R216 R221 R224-R226 R247 R271 R272 R289-R293 R504 U8

### Ports
32K_OUT (bidir), /EPHO_IN (out), /WB_PDN (in), AUD_RST (in), AUD_SCL (in), AUD_SDA (in), BTI2S_BCLK (in), BTI2S_DIN (in), BTI2S_DOUT (in), BTI2S_WCLK (in), BTUART_CTS (out), BTUART_RTS (in), BTUART_RXD (out), BTUART_TXD (in), CLK_32KPM (in), CSI0_MCLKA (in), FM_LON (in), FMI2C_SCL (in), FMI2C_SDA (in), HDI2C1_SCL (in), HDI2C1_SDA (in), HSIM_CLK (in), HSIM_I/O (bidir), HSIM_RST (in), I2S_BCLK (in), I2S_DIN (out), I2S_DOUT (in), I2S_MCLK (in), I2S_WCLK (in), KEYIN[0..5] (out), LED_G (in), LED_R (in), MP_INT (in), SD1_CD (out), SD1_CLK (in), SD1_CMD (bidir), SD1_D[0..3] (bidir), SD2_CLK (out), SD2_CMD (bidir), SD2_D[0..3] (out), UOTG_DN (bidir), UOTG_DP (bidir), WAN_WK (out), WB_RST (in), WLBT_WK (out)

### Nets
GND: C1.2 C2.1 C3.1 C36.1 C37.2 C44.2 C68.1 C70.2 C137.2 C139.1 C176.2 C180.1 C182.1 C185.2 C187.2 C188.2 C190.2 C191.1 C196.2 J4.2 J4.3 J12.2 J12.4 J12.6 J12.41 J12.42 Q5.2(S) Q14.2(S) Q15.2(S) R114.2 R120.1 R133.1 R207.1 R209.1 R211.1 R212.1 R214.1 R226.1 R344.1 R345.1 RL21.1 S62.6(GND) S62.7(GND) S63.6(GND) S63.7(GND) U8.1(GND) U8.3(GND) U8.13(FM_RX_GND) U8.49(GND) U8.55(GND) U8.56(GND) U8.57(GND) U8.59(GND) U8.60(GND) U8.61(GND) U8.62(GND) U8.63(GND) U8.64(GND) U8.65(GND) U8.66(GND) U8.67(GND) U28.1(IOVSS) U28.18(DVSS) U28.33(VSS)
HGND: C32.2 C33.2 C38.1 C148.2 C195.2 J12.7 J12.10 R184.1 R185.1 RL21.2 U28.16(AVSS) U28.20(SPLVSS) U28.25(SPRVSS) U28.29(HPVSS)
VAD_MICBIAS: R405.1 U28.12(MICBIAS)
VAD_MP3: C38.2 C148.1 C195.1 RL20.1 U28.17(AVDD) U28.21(SPLVDD) U28.24(SPRVDD) U28.28(HPVDD)
VAUD_DVDD: C68.2 C70.1 Q21.3(D) R120.2 U28.3(DVDD)
VBUS: J12.37 J12.38 J12.39 J12.40
VCC_1V8: C1.1 C37.1 Q21.2(S) Q28.2(S) R115.2 R116.2
VCC_3V: J12.1 R308.1 R309.1 R310.1 R311.1 R312.1 R313.1
VCC_CARD: J12.18
VCC_MP3: C36.2 C44.1 J12.26 R126.2 R168.2 R258.2 RL20.2 U28.2(IOVDD)
VCC_SIM: J12.34
VDD_WB18: C2.2 C137.1 C180.2 Q28.3(D) R133.2 R180.1 U8.33(VDD_1.8V)
VDD_WB33: C176.1 C185.1 C187.1 C188.1 C191.2 R186.1 R189.1 R210.2 R213.1 R221.2 R289.1 R290.1 R291.1 R292.1 R293.1 U8.21(VIO) U8.23(VDD_3.3V) U8.35(VDD_PA)
VDD_WBD12: C182.2 C190.1 U8.22(VDD_1.2V)
32K_OUT: R204.1 ; port 32K_OUT
/EPHO_IN: J12.17 ; port /EPHO_IN
/WB_PDN: R212.2 U8.45(PDn) ; port /WB_PDN
AUD_RST: U28.31(/RESET) ; port AUD_RST
AUD_SCL: R251.2 ; port AUD_SCL
AUD_SDA: R173.2 ; port AUD_SDA
BTI2S_BCLK: U8.39(GPIO_13) ; port BTI2S_BCLK
BTI2S_DIN: U8.38(GPIO_12) ; port BTI2S_DIN
BTI2S_DOUT: U8.41(GPIO_11) ; port BTI2S_DOUT
BTI2S_WCLK: U8.40(GPIO_14) ; port BTI2S_WCLK
BTUART_CTS: U8.29(GPIO_2) ; port BTUART_CTS
BTUART_RTS: U8.31(GPIO_8) ; port BTUART_RTS
BTUART_RXD: U8.27(GPIO_6) ; port BTUART_RXD
BTUART_TXD: U8.26(GPIO_7) ; port BTUART_TXD
CLK_32KPM: R504.1 ; port CLK_32KPM
CSI0_MCLKA: R247.1 ; port CSI0_MCLKA
FM_LON: R114.1 R172.2 ; port FM_LON
FM_RX: R208.2 R226.2 U8.14(FM_RX)
FMI2C_SCL: R272.2 ; port FMI2C_SCL
FMI2C_SCLA: R186.2 R272.1 U8.5(GPIO_9)
FMI2C_SDA: R271.2 ; port FMI2C_SDA
FMI2C_SDAA: R189.2 R271.1 U8.6(GPIO_10)
FMOUT_L: Q3.3(D) U8.16(FM_AUDIO_OUT_L)
FMOUT_LA: C186.2 U28.13(MIC1LP)
FMOUT_R: Q4.3(D) U8.17(FM_AUDIO_OUT_R)
FMOUT_RA: C189.2 U28.14(MIC1RP)
HDI2C1_SCL: R228.2 ; port HDI2C1_SCL
HDI2C1_SDA: R233.2 ; port HDI2C1_SDA
HP_LEFT: C179.1 J12.16 R64.2
HP_LEFTP: C194.1 U28.27(HPL)
HP_RIGHT: C183.1 J12.15 R1.2
HP_RIGHTP: C193.1 U28.30(HPR)
HSIM_CLK: J12.32 ; port HSIM_CLK
HSIM_I/O: J12.33 ; port HSIM_I/O
HSIM_RST: J12.31 ; port HSIM_RST
I2S_BCLK: U28.7(BCLK) ; port I2S_BCLK
I2S_DIN: U28.4(DOUT) ; port I2S_DIN
I2S_DOUT: U28.5(DIN) ; port I2S_DOUT
I2S_MCLK: R68.1 ; port I2S_MCLK
I2S_WCLK: U28.6(WCLK) ; port I2S_WCLK
KEYIN0: J12.27 R308.2
KEYIN1: J12.28 R309.2
KEYIN2: J12.29 R310.2
KEYIN3: J12.30 R311.2
KEYIN4: R312.2 S62.1(COMMON) S62.3(COMMON) T46.1(TP)
KEYIN5: R313.2 S63.1(COMMON) S63.3(COMMON) T47.1(TP)
LED_G: J12.36 ; port LED_G
LED_R: J12.35 ; port LED_R
MIC_DET: R410.1 U28.11(VOL/MICDET)
MICIN_L: C28.2 J12.11 RL2.1
MP_INT: J12.12 ; port MP_INT
SD1_CD: J12.25 ; port SD1_CD
SD1_CLK: R59.2 ; port SD1_CLK
SD1_CMD: R65.2 ; port SD1_CMD
SD1_D0: R39.2
SD1_D1: R41.2
SD1_D2: R46.2
SD1_D3: R47.2
SD2_CLK: R224.1 ; port SD2_CLK
SD2_CMD: R293.2 U8.11(SD_CMD) ; port SD2_CMD
SD2_D0: R289.2 U8.10(SD_D0)
SD2_D1: R290.2 U8.9(SD_D1)
SD2_D2: R291.2 U8.7(SD_D2)
SD2_D3: R292.2 U8.8(SD_D3)
SPCLK: C196.1 Q5.3(D) R180.2 R216.1
SPKL_M: J12.8 U28.19(SPLM)
SPKL_P: J12.9 U28.22(SPLP)
SPKR_M: J12.13 U28.23(SPRM)
SPKR_P: J12.14 U28.26(SPRP)
UOTG_DN: U11.3 ; port UOTG_DN
UOTG_DNA: J12.3 U11.4
UOTG_DP: U11.2 ; port UOTG_DP
UOTG_DPA: J12.5 U11.1
WAN_WK: R178.1 ; port WAN_WK
WB_RST: R210.1 U8.43(RESETn) ; port WB_RST
WF_RF: C3.2 R171.2 U8.2(WLAN_BT_ANT)
WLBT_WK: R174.1 ; port WLBT_WK
NetC28_1: C28.1 U28.15(MIC1LM)
NetC32_1: C32.1 R51.2 R405.2
NetC33_1: C33.1 R51.1 R410.2 RL2.2
NetC139_2: C139.2 J4.4 R171.1
NetC179_2: C179.2 C183.2 R225.1
NetC186_1: C186.1 Q3.2(S)
NetC189_1: C189.1 Q4.2(S)
NetC193_2: C193.2 R1.1 R184.2
NetC194_2: C194.2 R64.1 R185.2
NetJ12_19: J12.19 R39.1
NetJ12_20: J12.20 R41.1
NetJ12_21: J12.21 R46.1
NetJ12_22: J12.22 R47.1
NetJ12_23: J12.23 R59.1
NetJ12_24: J12.24 R65.1
NetQ3_1: Q3.1(G) Q4.1(G) R172.1
NetQ5_1: Q5.1(G) R204.2 R207.2 R504.2
NetQ14_1: Q14.1(G) R126.1
NetQ14_3: Q14.3(D) R124.1
NetQ15_1: Q15.1(G) R221.1
NetQ15_3: Q15.3(D) R147.1
NetQ21_1: Q21.1(G) R115.1 R124.2
NetQ28_1: Q28.1(G) R116.1 R147.2
NetR68_2: R68.2 U28.8(MCLK)
NetR168_1: R168.1 R228.1 R251.1 U28.10(SCL)
NetR173_1: R173.1 R233.1 R258.1 U28.9(SDA)
NetR174_2: R174.2 U8.53(GPIO_4)
NetR178_2: R178.2 U8.54(GPIO_16)
NetR208_1: R208.1 R225.2
NetR209_2: R209.2 U8.44(SER_CSn)
NetR211_2: R211.2 U8.42(RF_CNTL2_N)
NetR213_2: R213.2 U8.58(WP)
NetR214_2: R214.2 U8.36(RF_CNTL6_N)
NetR216_2: R216.2 U8.12(SLEEP_CLK)
NetR224_2: R224.2 U8.18(SD_CLK)
NetR247_2: R247.2 U8.37(GPIO_15)
NetR344_2: R344.2 S62.2(NO)
NetR345_2: R345.2 S63.2(NO)

Not connected (* = marked no-connect by the designer): U8 4(TDO) 15(FM_TX) 19(GPIO_23) 20(GPIO_22) 24(GPIO_20) 25(GPIO_21) 28(GPIO_3) 30(GPIO_5) 32(GPIO_1) 34(GPIO_17) 46(TMS) 47(TCK) 48(TDI) 50(FM_AUDIO_IN_R) 51(FM_AUDIO_IN_L) 52(W1_CNTL); U28 32(GPIO1)

### Buses and harness runs
bus KEYIN[0..5] = port KEYIN[0..5]
bus SD1_D[0..3] = port SD1_D[0..3]
bus SD2_D[0..3] = port SD2_D[0..3]

### Notes on the sheet
- (near T46) 音量"+"
- 150mA/1.8V
- (near T47) 音量"-"
- (near R120) N.M.
- (near R504) N.M.
- (near R174) N.M.
- (near R209) N.M.
- (near R178) N.M.
- 300mA/1.8V
- (near R133) N.M.
- (near R214) N.M.
- (near R247) N.M.
- (near C3) N.M.
- (near C139) 50欧姆
- (near C139) N.M.
- 设   计
- 审   核
- audio&wifi&GPS&Key
- 标 准 化
- 批   准
- JEAC605UM-FTTSC-2.0
- 阶 段
- 标 记
- 第 7 张
- 共 8 张

### Library data of the parts
C1-C3 C28 C32 C33 C36-C38 C44 C68 C70 C137 C139 C148 C176 C179 C180 C182 C183 C185-C191 C195 C196 = CAP: Capacitor
C193 C194 = CAPACITOR
J4 = 4 HEADER: 4 Pin Header
Q3-Q5 Q14 Q15 = MOSFET N
Q21 Q28 = SI1021
R1 R39 R41 R46 R47 R51 R59 R64 R65 R68 R114-R116 R120 R124 R126 R133 R147 R168 R171-R174 R178 R180 R184-R186 R189 R204 R207-R214 R216 R221 R224-R226 R228 R233 R247 R251 R258 R271 R272 R289-R293 R308-R313 R344 R345 R405 R410 R504 = RES1
RL2 RL20 RL21 = INDUCTOR

## Sheet ELCD.schdoc
size B; SheetNumber: 4; SheetTotal: 8
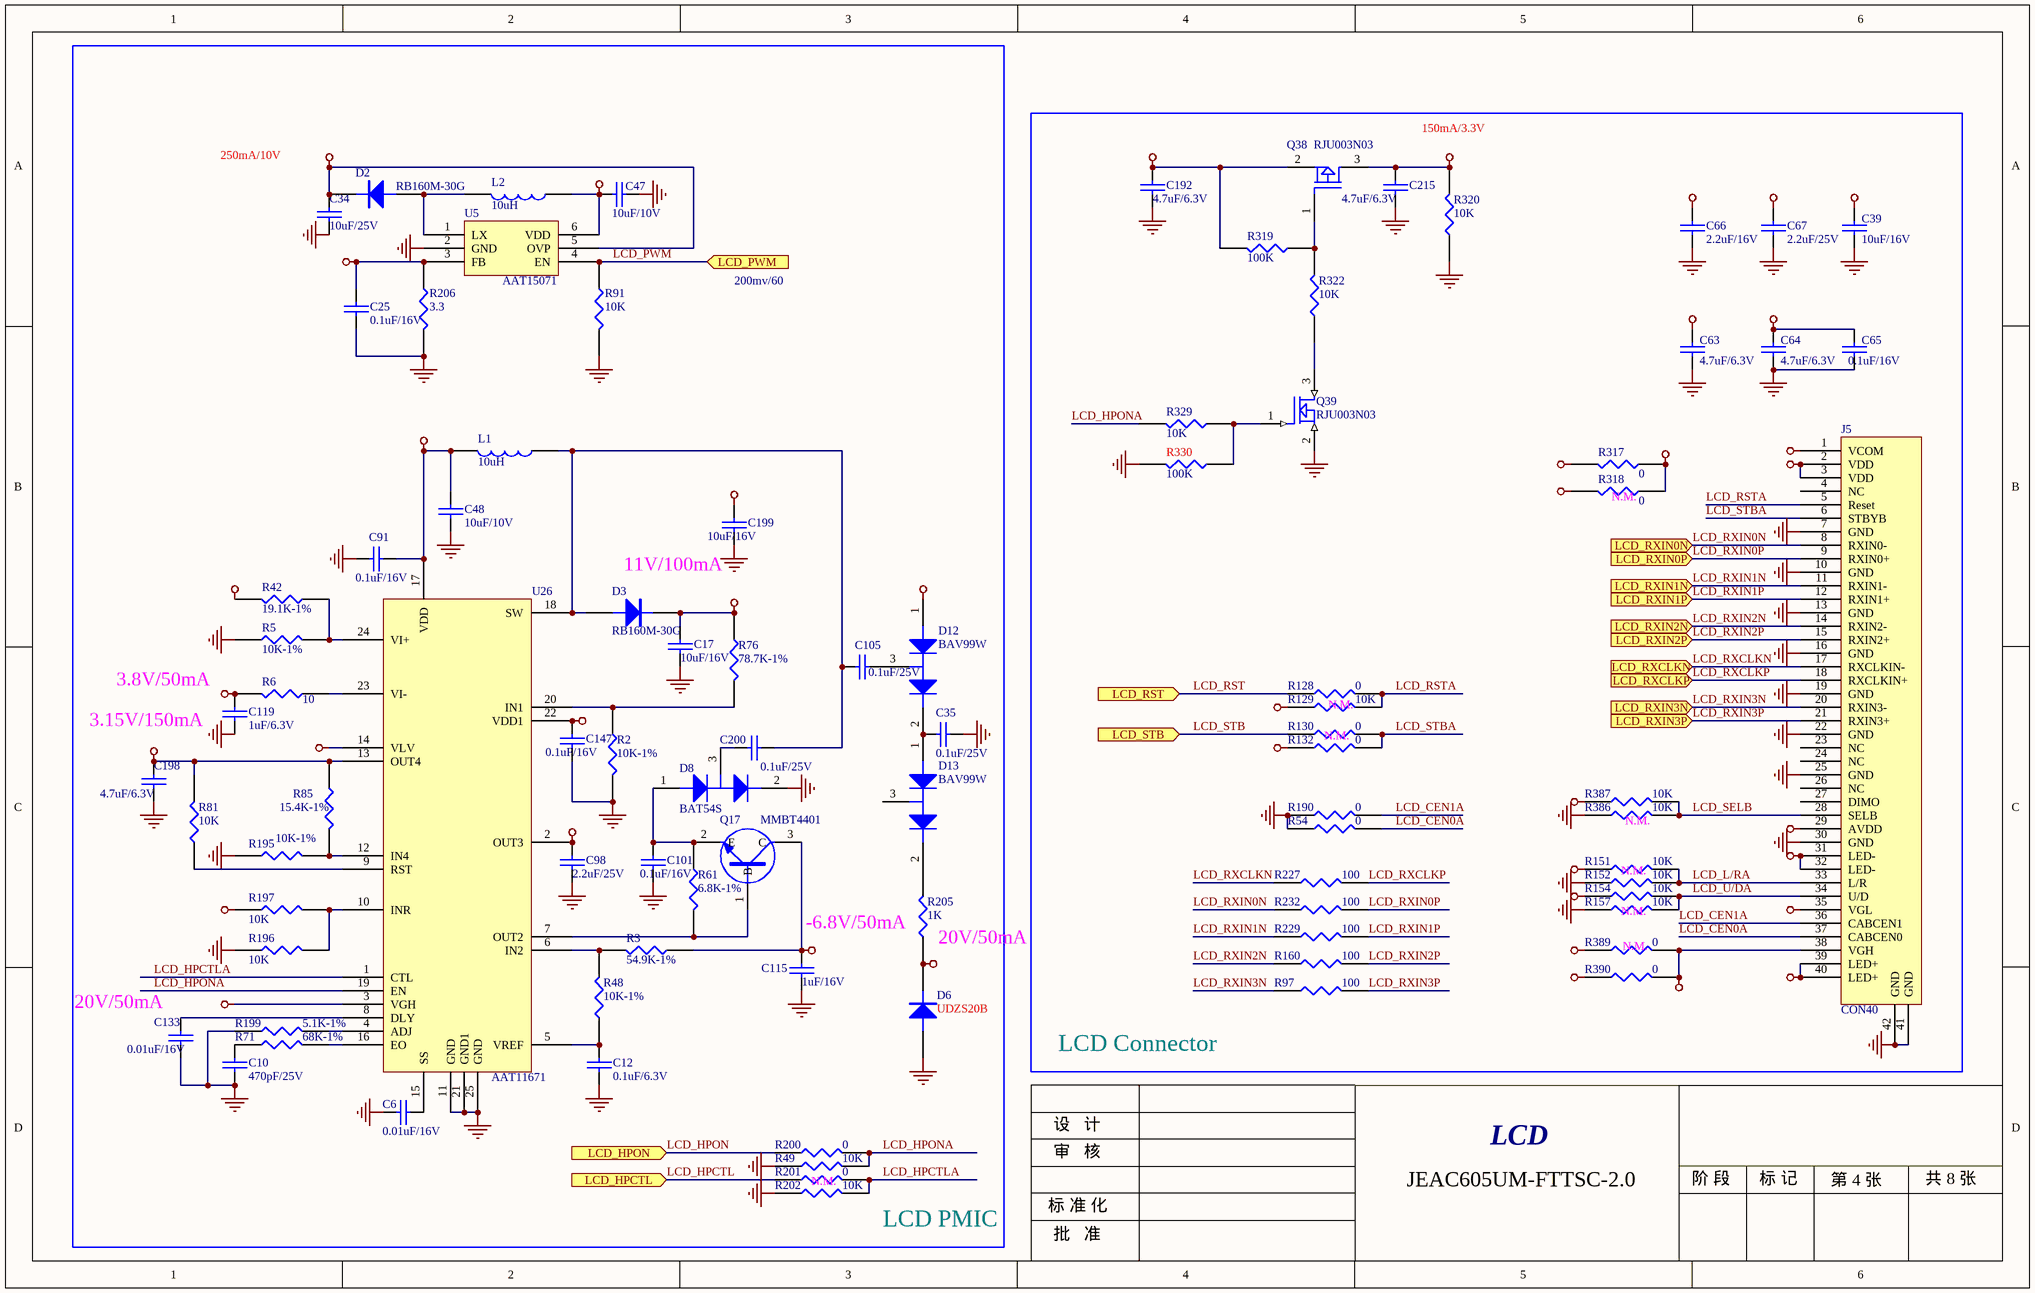
[diagram p11: ELCD.schdoc]

### Parts
C6  0.01uF/16V  [C0402]
C10  470pF/25V  [C0402]
C12  0.1uF/6.3V  [C0402]
C17  10uF/16V  [C1206]
C25  0.1uF/16V  [C0402]
C34  10uF/25V  [C1206]
C35  0.1uF/25V  [C0603]
C39  10uF/16V  [C1206]
C47  10uF/10V  [C0805]
C48  10uF/10V  [C0805]
C63  4.7uF/6.3V  [C0603]
C64  4.7uF/6.3V  [C0603]
C65  0.1uF/16V  [C0402]
C66  2.2uF/16V  [C0805]
C67  2.2uF/25V  [C0805]
C91  0.1uF/16V  [C0402]
C98  0.1uF/16V  [C0805]
C101  2.2uF/25V  [C0402]
C105  0.1uF/25V  [C0603]
C115  1uF/16V  [C0603]
C119  1uF/6.3V  [C0402]
C133  0.01uF/16V  [C0402]
C147  0.1uF/16V  [C0402]
C192  4.7uF/6.3V  [C0603]
C198  4.7uF/6.3V  [C0603]
C199  10uF/16V  [C1206]
C200  0.1uF/25V  [C0603]
C215  4.7uF/6.3V  [C0603]
D2  RB160M-30G  [SOD-123]
D3  RB160M-30G  [SOD-123]
D6  UDZS20B  [UDZS24B]
D8  BAT54S  [SOT-23]
D12  BAV99W  [SOT-23]
D13  BAV99W  [SOT-23]
J5  CON40  [j-con-40-0_5f]
L1  10uH  [l-2-EIA1008]
L2  10uH  [l-2-EIA1008]
Q17  MMBT4401  [SOT-23-NPN]
Q38  RJU003N03  [SOT-23]
Q39  RJU003N03  [SOT-23-NPN]
R2  10K-1%  [R0402]
R3  54.9K-1%  [R0402]
R5  10K-1%  [R0402]
R6  10  [R0402]
R42  19.1K-1%  [R0402]
R48  10K-1%  [R0402]
R49  10K  [R0402]
R54  0  [R0402]
R61  6.8K-1%  [R0402]
R71  68K-1%  [R0402]
R76  78.7K-1%  [R0402]
R81  10K  [R0402]
R85  15.4K-1%  [R0402]
R91  10K  [R0402]
R97  100  [R0402]
R128  0  [R0402]
R129  10K  [R0402]
R130  0  [R0402]
R132  0  [R0402]
R151  10K  [R0402]
R152  10K  [R0402]
R154  10K  [R0402]
R157  10K  [R0402]
R160  100  [R0402]
R190  0  [R0402]
R195  10K-1%  [R0402]
R196  10K  [R0402]
R197  10K  [R0402]
R199  5.1K-1%  [R0402]
R200  0  [R0402]
R201  0  [R0402]
R202  10K  [R0402]
R205  1K  [R0603]
R206  3.3  [R0603]
R227  100  [R0402]
R229  100  [R0402]
R232  100  [R0402]
R317  0  [R0402]
R318  0  [R0402]
R319  100K  [R0402]
R320  10K  [R0402]
R322  10K  [R0402]
R329  10K  [R0402]
R330  100K  [R0402]
R386  10K  [R0402]
R387  10K  [R0402]
R389  0  [R0402]
R390  0  [R0402]
U5  AAT15071  [SOT23-6-0_95]
U26  AAT11671  [U-QFN-24-0_5]

### Blocks framed on the sheet
LCD PMIC: C6 C10 C12 C17 C25 C34 C35 C47 C48 C91 C98 C101 C105 C115 C119 C133 C147 C198-C200 D2 D3 D6 D8 D12 D13 L1 L2 Q17 R2 R3 R5 R6 R42 R48 R49 R61 R71 R76 R81 R85 R91 R195-R197 R199-R202 R205 R206 U5 U26
LCD Connector: C39 C63-C67 C192 C215 J5 Q38 Q39 R54 R97 R128-R130 R132 R151 R152 R154 R157 R160 R190 R227 R229 R232 R317-R320 R322 R329 R330 R386 R387 R389 R390

### Ports
LCD_HPCTL (in), LCD_HPON (in), LCD_PWM (in), LCD_RST (in), LCD_RXCLKN (in), LCD_RXCLKP (in), LCD_RXIN0N (in), LCD_RXIN0P (in), LCD_RXIN1N (in), LCD_RXIN1P (in), LCD_RXIN2N (in), LCD_RXIN2P (in), LCD_RXIN3N (in), LCD_RXIN3P (in), LCD_STB (in)

### Nets
BLED_N: C25.1 J5.31(LED-) J5.32(LED-) R206.1 U5.3(FB)
BLED_P: C34.2 D2.2 J5.39(LED+) J5.40(LED+) U5.5(OVP)
GND: C6.2 C10.1 C12.2 C17.1 C25.2 C34.1 C35.2 C39.2 C47.2 C48.1 C63.2 C64.2 C65.2 C66.1 C67.1 C91.2 C98.1 C101.2 C115.1 C119.1 C133.2 C147.2 C192.2 C198.2 C199.1 C215.1 D6.1 D8.2 J5.7(GND) J5.10(GND) J5.13(GND) J5.16(GND) J5.19(GND) J5.22(GND) J5.25(GND) J5.30(GND) J5.41(GND) J5.42(GND) Q39.2(S) R2.2 R5.1 R49.1 R54.1 R91.2 R152.1 R157.1 R190.1 R195.1 R196.1 R199.1 R202.1 R206.2 R320.1 R330.2 R386.1 U5.2(GND) U26.11(GND) U26.21(GND1) U26.25(GND)
LCD_AVDD: C17.2 C39.1 C147.1 C199.2 D3.2 D12.1 J5.29(AVDD) R42.2 R76.1 U26.22(VDD1)
LCD_VCOM: C63.1 C119.2 J5.1(VCOM) R6.2
LCD_VGH: C67.2 J5.38(VGH) R389.2 R390.2
LCD_VGL: C66.2 C115.2 J5.35(VGL) Q17.3(C) R3.1
V_HS: C47.1 C48.2 C91.1 L1.2 L2.1 U5.6(VDD) U26.14(VLV) U26.17(VDD)
VCC_3V: C192.1 Q38.2(S) R319.2
VCC_LCD: C64.1 C65.1 J5.2(VDD) J5.3(VDD) R129.1 R132.1 R151.1 R154.1 R317.1 R318.1 R387.1
VCC_LCD1: C198.1 R81.2 R85.1 R197.1 R318.2 U26.13(OUT4)
VCC_LCD2: C215.2 Q38.3(D) R317.2 R320.2
VDD_VGH: R390.1 U26.3(VGH)
VOUT3: C98.2 D6.2 R205.1 R389.1 U26.2(OUT3)
LCD_CEN0A: J5.37(CABCEN0) R54.2
LCD_CEN1A: J5.36(CABCEN1) R190.2
LCD_HPCTL: R201.1 ; port LCD_HPCTL
LCD_HPCTLA: R201.2 R202.2 U26.1(CTL)
LCD_HPON: R200.1 ; port LCD_HPON
LCD_HPONA: R49.2 R200.2 R329.2 U26.19(EN)
LCD_L/RA: J5.33(L/R) R151.2 R152.2
LCD_PWM: R91.1 U5.4(EN) ; port LCD_PWM
LCD_RST: R128.1 ; port LCD_RST
LCD_RSTA: J5.5(Reset) R128.2 R129.2
LCD_RXCLKN: J5.17(RXCLKIN-) R227.1 ; port LCD_RXCLKN
LCD_RXCLKP: J5.18(RXCLKIN+) R227.2 ; port LCD_RXCLKP
LCD_RXIN0N: J5.8(RXIN0-) R232.1 ; port LCD_RXIN0N
LCD_RXIN0P: J5.9(RXIN0+) R232.2 ; port LCD_RXIN0P
LCD_RXIN1N: J5.11(RXIN1-) R229.1 ; port LCD_RXIN1N
LCD_RXIN1P: J5.12(RXIN1+) R229.2 ; port LCD_RXIN1P
LCD_RXIN2N: J5.14(RXIN2-) R160.1 ; port LCD_RXIN2N
LCD_RXIN2P: J5.15(RXIN2+) R160.2 ; port LCD_RXIN2P
LCD_RXIN3N: J5.20(RXIN3-) R97.1 ; port LCD_RXIN3N
LCD_RXIN3P: J5.21(RXIN3+) R97.2 ; port LCD_RXIN3P
LCD_SELB: J5.28(SELB) R386.2 R387.2
LCD_STB: R130.1 ; port LCD_STB
LCD_STBA: J5.6(STBYB) R130.2 R132.2
LCD_U/DA: J5.34(U/D) R154.2 R157.2
NetC6_1: C6.1 U26.15(SS)
NetC10_2: C10.2 R71.1
NetC12_1: C12.1 R48.1 U26.5(VREF)
NetC35_1: C35.1 D12.2 D13.1
NetC101_1: C101.1 D8.1 Q17.2(E) R61.1
NetC105_1: C105.1 C200.2 D3.1 L1.1 U26.18(SW)
NetC105_2: C105.2 D12.3
NetC133_1: C133.1 U26.8(DLY)
NetC200_1: C200.1 D8.3
NetD2_1: D2.1 L2.2 U5.1(LX)
NetD13_2: D13.2 R205.2
NetQ17_1: Q17.1(B) R61.2 U26.7(OUT2)
NetQ38_1: Q38.1(G) R319.1 R322.2
NetQ39_1: Q39.1(G) R329.1 R330.1
NetQ39_3: Q39.3(D) R322.1
NetR2_1: R2.1 R76.2 U26.20(IN1)
NetR3_2: R3.2 R48.2 U26.6(IN2)
NetR5_2: R5.2 R42.1 U26.24(VI+)
NetR6_1: R6.1 U26.23(VI-)
NetR71_2: R71.2 U26.16(EO)
NetR81_1: R81.1 U26.9(RST)
NetR85_2: R85.2 R195.2 U26.12(IN4)
NetR196_2: R196.2 R197.2 U26.10(INR)
NetR199_2: R199.2 U26.4(ADJ)

Not connected (* = marked no-connect by the designer): D13 3; J5 4(NC) 23(NC) 24(NC) 26(NC) 27(DIMO)

### Notes on the sheet
- 250mA/10V
- 150mA/3.3V
- 200mv/60
- (near R318) N.M.
- 11V/100mA
- (near C119) 3.8V/50mA
- (near R129) N.M.
- 3.15V/150mA
- N.M.
- (near R386) N.M.
- -6.8V/50mA
- (near R205) 20V/50mA
- (near R157) N.M.
- (near R389) N.M.
- (near C133) 20V/50mA
- 设   计
- 审   核
- LCD
- 标 准 化
- 批   准
- JEAC605UM-FTTSC-2.0
- 阶 段
- 标 记
- 第 4 张
- 共 8 张

### Library data of the parts
C6 C10 C12 C17 C25 C34 C35 C39 C47 C48 C63-C67 C91 C98 C101 C105 C115 C119 C133 C147 C192 C198-C200 C215 = CAP: Capacitor
D2 D3 D6 = DIODE
D8 D12 D13 = MBRS1100
L1 L2 = INDUCTOR1
Q17 = NPN: NPN Transistor
Q38 = SI1021
Q39 = MOSFET N
R2 R3 R5 R6 R42 R48 R49 R54 R61 R71 R76 R81 R85 R91 R97 R128-R130 R132 R151 R152 R154 R157 R160 R190 R195-R197 R199-R202 R205 R206 R227 R229 R232 R317-R320 R322 R329 R330 R386 R387 R389 R390 = RES1

## Sheet CPU3.schdoc
size B; SheetNumber: 3; SheetTotal: 8
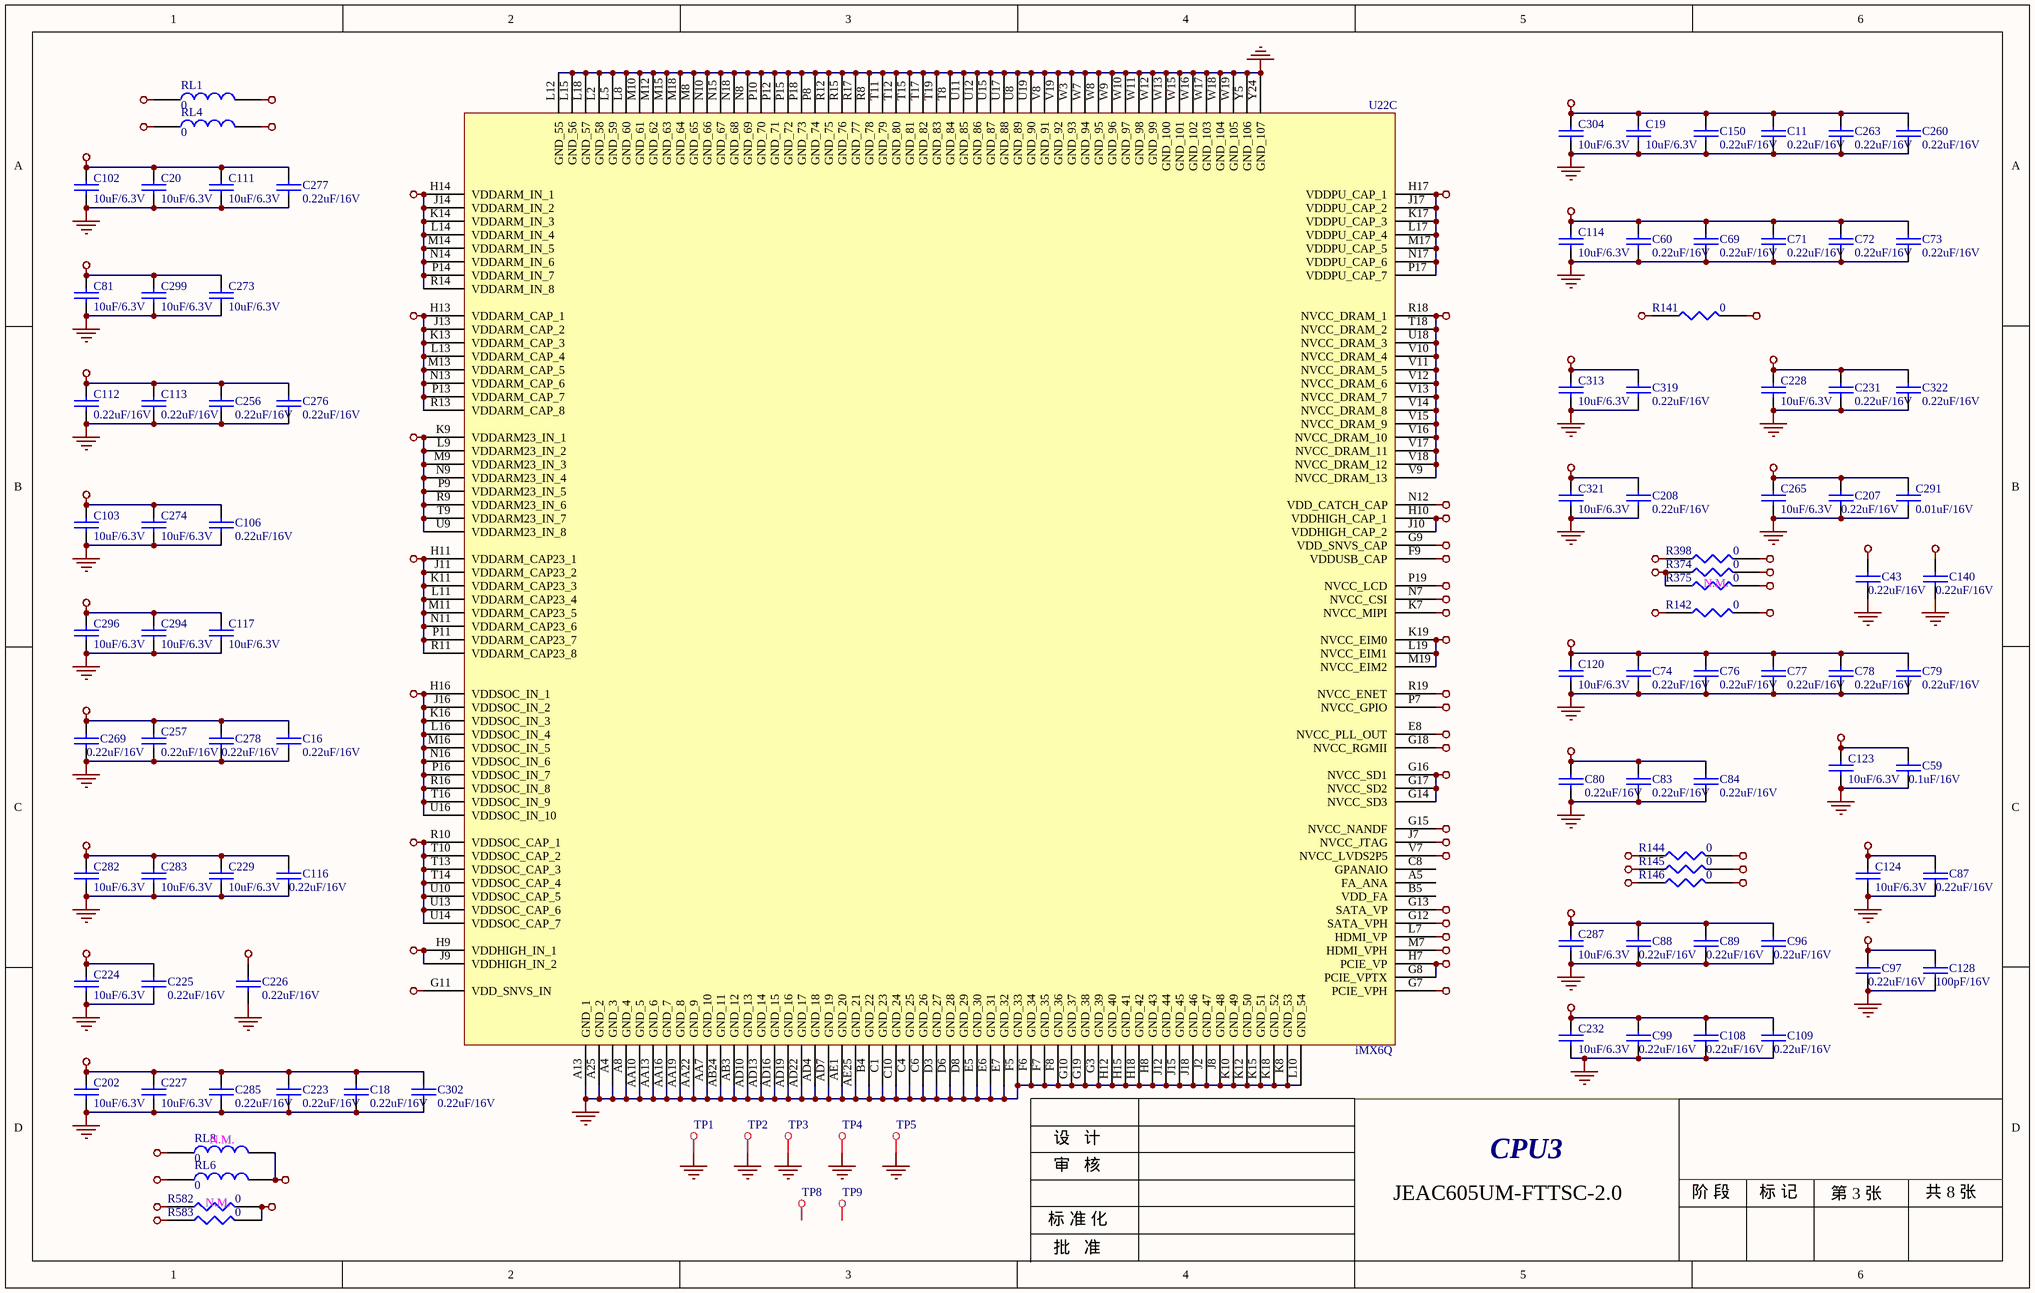
[diagram p12: CPU3.schdoc]

### Parts
C11  0.22uF/16V  [C0402]
C16  0.22uF/16V  [C0402]
C18  0.22uF/16V  [C0402]
C19  10uF/6.3V  [C0603]
C20  10uF/6.3V  [C0603]
C43  0.22uF/16V  [C0402]
C59  0.1uF/16V  [C0402]
C60  0.22uF/16V  [C0402]
C69  0.22uF/16V  [C0402]
C71  0.22uF/16V  [C0402]
C72  0.22uF/16V  [C0402]
C73  0.22uF/16V  [C0402]
C74  0.22uF/16V  [C0402]
C76  0.22uF/16V  [C0402]
C77  0.22uF/16V  [C0402]
C78  0.22uF/16V  [C0402]
C79  0.22uF/16V  [C0402]
C80  0.22uF/16V  [C0402]
C81  10uF/6.3V  [C0603]
C83  0.22uF/16V  [C0402]
C84  0.22uF/16V  [C0402]
C87  0.22uF/16V  [C0402]
C88  0.22uF/16V  [C0402]
C89  0.22uF/16V  [C0402]
C96  0.22uF/16V  [C0402]
C97  0.22uF/16V  [C0402]
C99  0.22uF/16V  [C0402]
C102  10uF/6.3V  [C0603]
C103  10uF/6.3V  [C0603]
C106  0.22uF/16V  [C0402]
C108  0.22uF/16V  [C0402]
C109  0.22uF/16V  [C0402]
C111  10uF/6.3V  [C0603]
C112  0.22uF/16V  [C0402]
C113  0.22uF/16V  [C0402]
C114  10uF/6.3V  [C0603]
C116  0.22uF/16V  [C0402]
C117  10uF/6.3V  [C0603]
C120  10uF/6.3V  [C0603]
C123  10uF/6.3V  [C0603]
C124  10uF/6.3V  [C0603]
C128  100pF/16V  [C0402]
C140  0.22uF/16V  [C0402]
C150  0.22uF/16V  [C0402]
C202  10uF/6.3V  [C0603]
C207  0.22uF/16V  [C0402]
C208  0.22uF/16V  [C0402]
C223  0.22uF/16V  [C0402]
C224  10uF/6.3V  [C0603]
C225  0.22uF/16V  [C0402]
C226  0.22uF/16V  [C0402]
C227  10uF/6.3V  [C0603]
C228  10uF/6.3V  [C0603]
C229  10uF/6.3V  [C0603]
C231  0.22uF/16V  [C0402]
C232  10uF/6.3V  [C0603]
C256  0.22uF/16V  [C0402]
C257  0.22uF/16V  [C0402]
C260  0.22uF/16V  [C0402]
C263  0.22uF/16V  [C0402]
C265  10uF/6.3V  [C0603]
C269  0.22uF/16V  [C0402]
C273  10uF/6.3V  [C0603]
C274  10uF/6.3V  [C0603]
C276  0.22uF/16V  [C0402]
C277  0.22uF/16V  [C0402]
C278  0.22uF/16V  [C0402]
C282  10uF/6.3V  [C0603]
C283  10uF/6.3V  [C0603]
C285  0.22uF/16V  [C0402]
C287  10uF/6.3V  [C0603]
C291  0.01uF/16V  [C0402]
C294  10uF/6.3V  [C0603]
C296  10uF/6.3V  [C0603]
C299  10uF/6.3V  [C0603]
C302  0.22uF/16V  [C0402]
C304  10uF/6.3V  [C0603]
C313  10uF/6.3V  [C0603]
C319  0.22uF/16V  [C0402]
C321  10uF/6.3V  [C0603]
C322  0.22uF/16V  [C0402]
R141  0  [R0402]
R142  0  [R0402]
R144  0  [R0402]
R145  0  [R0402]
R146  0  [R0402]
R374  0  [R0402]
R375  0  [R0402]
R398  0  [R0402]
R582  0  [R0402]
R583  0  [R0402]
RL1  0  [L0805]
RL4  0  [L0603]
RL6  0  [L0603]
RL8  0  [L0603]
TP1  Testpoint  [PC3_5D2_0]  (value not drawn)
TP2  Testpoint  [PC3_5D2_0]  (value not drawn)
TP3  Testpoint  [PC3_5D2_0]  (value not drawn)
TP4  Testpoint  [PC3_5D2_0]  (value not drawn)
TP5  Testpoint  [PC3_5D2_0]  (value not drawn)
TP8  Testpoint  [MTH059_06]  (value not drawn)
TP9  Testpoint  [MTH059_06]  (value not drawn)
U22  iMX6Q  [U-BGA-624-0_8]  (part C of 3)

### Nets
GND: C11.2 C16.2 C18.2 C19.2 C20.2 C43.2 C59.2 C60.2 C69.2 C71.2 C72.2 C73.2 C74.2 C76.2 C77.2 C78.2 C79.2 C80.2 C81.2 C83.2 C84.2 C87.2 C88.2 C89.2 C96.2 C97.2 C99.2 C102.2 C103.2 C106.2 C108.2 C109.2 C111.2 C112.2 C113.2 C114.2 C116.2 C117.2 C120.2 C123.2 C124.2 C128.2 C140.2 C150.2 C202.2 C207.2 C208.2 C223.2 C224.2 C225.2 C226.2 C227.2 C228.2 C229.2 C231.2 C232.2 C256.2 C257.2 C260.2 C263.2 C265.2 C269.2 C273.2 C274.2 C276.2 C277.2 C278.2 C282.2 C283.2 C285.2 C287.2 C291.2 C294.2 C296.2 C299.2 C302.2 C304.2 C313.2 C319.2 C321.2 C322.2 TP1.1(TP) TP2.1(TP) TP3.1(TP) TP4.1(TP) TP5.1(TP) U22.A4(GND_3) U22.A8(GND_4) U22.A13(GND_1) U22.A25(GND_2) U22.AA7(GND_10) U22.AA10(GND_5) U22.AA13(GND_6) U22.AA16(GND_7) U22.AA19(GND_8) U22.AA22(GND_9) U22.AB3(GND_12) U22.AB24(GND_11) U22.AD4(GND_18) U22.AD7(GND_19) U22.AD10(GND_13) U22.AD13(GND_14) U22.AD16(GND_15) U22.AD19(GND_16) U22.AD22(GND_17) U22.AE1(GND_20) U22.AE25(GND_21) U22.B4(GND_22) U22.C1(GND_23) U22.C4(GND_25) U22.C6(GND_26) U22.C10(GND_24) U22.D3(GND_27) U22.D6(GND_28) U22.D8(GND_29) U22.E5(GND_30) U22.E6(GND_31) U22.E7(GND_32) U22.F5(GND_33) U22.F6(GND_34) U22.F7(GND_35) U22.F8(GND_36) U22.G3(GND_39) U22.G10(GND_37) U22.G19(GND_38) U22.H8(GND_43) U22.H12(GND_40) U22.H15(GND_41) U22.H18(GND_42) U22.J2(GND_47) U22.J8(GND_48) U22.J12(GND_44) U22.J15(GND_45) U22.J18(GND_46) U22.K8(GND_53) U22.K10(GND_49) U22.K12(GND_50) U22.K15(GND_51) U22.K18(GND_52) U22.L2(GND_58) U22.L5(GND_59) U22.L8(GND_60) U22.L10(GND_54) U22.L12(GND_55) U22.L15(GND_56) U22.L18(GND_57) U22.M8(GND_65) U22.M10(GND_61) U22.M12(GND_62) U22.M15(GND_63) U22.M18(GND_64) U22.N8(GND_69) U22.N10(GND_66) U22.N15(GND_67) U22.N18(GND_68) U22.P8(GND_74) U22.P10(GND_70) U22.P12(GND_71) U22.P15(GND_72) U22.P18(GND_73) U22.R8(GND_78) U22.R12(GND_75) U22.R15(GND_76) U22.R17(GND_77) U22.T8(GND_84) U22.T11(GND_79) U22.T12(GND_80) U22.T15(GND_81) U22.T17(GND_82) U22.T19(GND_83) U22.U8(GND_89) U22.U11(GND_85) U22.U12(GND_86) U22.U15(GND_87) U22.U17(GND_88) U22.U19(GND_90) U22.V8(GND_91) U22.V19(GND_92) U22.W3(GND_93) U22.W7(GND_94) U22.W8(GND_95) U22.W9(GND_96) U22.W10(GND_97) U22.W11(GND_98) U22.W12(GND_99) U22.W13(GND_100) U22.W15(GND_101) U22.W16(GND_102) U22.W17(GND_103) U22.W18(GND_104) U22.W19(GND_105) U22.Y5(GND_106) U22.Y24(GND_107)
NVCC_PLL_OUT: C207.1 C265.1 C291.1 R142.1 U22.E8(NVCC_PLL_OUT)
VCC_1V1: R142.2
VCC_1V5: C87.1 C124.1 U22.G18(NVCC_RGMII)
VCC_2V8: R398.2
VCC_3V: C74.1 C76.1 C77.1 C78.1 C79.1 C80.1 C83.1 C84.1 C120.1 RL8.1 U22.G14(NVCC_SD3) U22.G15(NVCC_NANDF) U22.G16(NVCC_SD1) U22.G17(NVCC_SD2) U22.J7(NVCC_JTAG) U22.K19(NVCC_EIM0) U22.L19(NVCC_EIM1) U22.M19(NVCC_EIM2) U22.P7(NVCC_GPIO) U22.P19(NVCC_LCD) U22.R19(NVCC_ENET)
VCC_3V1: R582.1 RL6.1
VCC_CSI: C43.1 R398.1 U22.N7(NVCC_CSI)
VCC_MIPI: C140.1 R374.1 R375.1 U22.K7(NVCC_MIPI)
VCC_MIPIB: R375.2
VDD_ARM23_IN: C103.1 C106.1 C274.1 RL1.2 U22.K9(VDDARM23_IN_1) U22.L9(VDDARM23_IN_2) U22.M9(VDDARM23_IN_3) U22.N9(VDDARM23_IN_4) U22.P9(VDDARM23_IN_5) U22.R9(VDDARM23_IN_6) U22.T9(VDDARM23_IN_7) U22.U9(VDDARM23_IN_8)
VDD_ARM_CAP: C81.1 C112.1 C113.1 C256.1 C273.1 C276.1 C299.1 RL4.1 U22.H13(VDDARM_CAP_1) U22.J13(VDDARM_CAP_2) U22.K13(VDDARM_CAP_3) U22.L13(VDDARM_CAP_4) U22.M13(VDDARM_CAP_5) U22.N13(VDDARM_CAP_6) U22.P13(VDDARM_CAP_7) U22.R13(VDDARM_CAP_8)
VDD_ARM_CAP23: C16.1 C117.1 C257.1 C269.1 C278.1 C294.1 C296.1 RL4.2 U22.H11(VDDARM_CAP23_1) U22.J11(VDDARM_CAP23_2) U22.K11(VDDARM_CAP23_3) U22.L11(VDDARM_CAP23_4) U22.M11(VDDARM_CAP23_5) U22.N11(VDDARM_CAP23_6) U22.P11(VDDARM_CAP23_7) U22.R11(VDDARM_CAP23_8)
VDD_ARM_IN: C20.1 C102.1 C111.1 C277.1 RL1.1 U22.H14(VDDARM_IN_1) U22.J14(VDDARM_IN_2) U22.K14(VDDARM_IN_3) U22.L14(VDDARM_IN_4) U22.M14(VDDARM_IN_5) U22.N14(VDDARM_IN_6) U22.P14(VDDARM_IN_7) U22.R14(VDDARM_IN_8)
VDD_CACHE: C313.1 C319.1 R141.1 U22.N12(VDD_CATCH_CAP)
VDD_DRAM_1.2V: C60.1 C69.1 C71.1 C72.1 C73.1 C114.1 U22.R18(NVCC_DRAM_1) U22.T18(NVCC_DRAM_2) U22.U18(NVCC_DRAM_3) U22.V9(NVCC_DRAM_13) U22.V10(NVCC_DRAM_4) U22.V11(NVCC_DRAM_5) U22.V12(NVCC_DRAM_6) U22.V13(NVCC_DRAM_7) U22.V14(NVCC_DRAM_8) U22.V15(NVCC_DRAM_9) U22.V16(NVCC_DRAM_10) U22.V17(NVCC_DRAM_11) U22.V18(NVCC_DRAM_12)
VDD_HIGH: C228.1 C231.1 C322.1 R144.2 R146.2 R374.2 U22.H10(VDDHIGH_CAP_1) U22.J10(VDDHIGH_CAP_2)
VDD_LVDS2P5: C97.1 C128.1 R146.1 U22.V7(NVCC_LVDS2P5)
VDD_SNVS: C208.1 C321.1 U22.G9(VDD_SNVS_CAP)
VDD_SNVS_IN: C226.1 R582.2 R583.2 U22.G11(VDD_SNVS_IN)
VDD_SOC: C18.1 C202.1 C223.1 C227.1 C285.1 C302.1 R141.2 R145.2 U22.R10(VDDSOC_CAP_1) U22.T10(VDDSOC_CAP_2) U22.T13(VDDSOC_CAP_3) U22.T14(VDDSOC_CAP_4) U22.U10(VDDSOC_CAP_5) U22.U13(VDDSOC_CAP_6) U22.U14(VDDSOC_CAP_7)
VDD_SOC_IN: C116.1 C229.1 C282.1 C283.1 U22.H16(VDDSOC_IN_1) U22.J16(VDDSOC_IN_2) U22.K16(VDDSOC_IN_3) U22.L16(VDDSOC_IN_4) U22.M16(VDDSOC_IN_5) U22.N16(VDDSOC_IN_6) U22.P16(VDDSOC_IN_7) U22.R16(VDDSOC_IN_8) U22.T16(VDDSOC_IN_9) U22.U16(VDDSOC_IN_10)
VDD_SRTC_MX: R583.1
VDD_VP: C88.1 C89.1 C96.1 C287.1 R145.1 U22.G8(PCIE_VPTX) U22.G13(SATA_VP) U22.H7(PCIE_VP) U22.L7(HDMI_VP)
VDD_VPH: C99.1 C108.1 C109.1 C232.1 R144.1 U22.G7(PCIE_VPH) U22.G12(SATA_VPH) U22.M7(HDMI_VPH)
VDD_VPU: C11.1 C19.1 C150.1 C260.1 C263.1 C304.1 U22.H17(VDDPU_CAP_1) U22.J17(VDDPU_CAP_2) U22.K17(VDDPU_CAP_3) U22.L17(VDDPU_CAP_4) U22.M17(VDDPU_CAP_5) U22.N17(VDDPU_CAP_6) U22.P17(VDDPU_CAP_7)
VDDHIGH_IN: C224.1 C225.1 RL6.2 RL8.2 U22.H9(VDDHIGH_IN_1) U22.J9(VDDHIGH_IN_2)
VDDUSB_CAP: C59.1 C123.1 U22.F9(VDDUSB_CAP)

Not connected (* = marked no-connect by the designer): TP8 1(TP); TP9 1(TP); U22 A5(FA_ANA) B5(VDD_FA) C8(GPANAIO)

### Notes on the sheet
- (near R375) N.M.
- (near RL8) N.M.
- 设   计
- 审   核
- CPU3
- (near R582) N.M.
- 标 准 化
- JEAC605UM-FTTSC-2.0
- 阶 段
- 标 记
- 第 3 张
- 共 8 张
- 批   准

### Library data of the parts
C11 C16 C18-C20 C43 C59 C60 C69 C71-C74 C76-C81 C83 C84 C87-C89 C96 C97 C99 C102 C103 C106 C108 C109 C111-C114 C116 C117 C120 C123 C124 C128 C140 C150 C202 C207 C208 C223-C229 C231 C232 C256 C257 C260 C263 C265 C269 C273 C274 C276-C278 C282 C283 C285 C287 C291 C294 C296 C299 C302 C304 C313 C319 C321 C322 = CAP: Capacitor
R141 R142 R144-R146 R374 R375 R398 R582 R583 = RES1
RL1 RL4 RL6 RL8 = INDUCTOR
U22 = IMX6Q: pin to pad: A4>132 A5>U12 A8>133 A12>A10 A13>130 A14>A12 A15>F17 A16>83 A17>85 A19>91 A25>131 AA7>139 AA16>136 AA22>138 AA23>72 AA24>Y23 AA25>Y22 AB3>141 AB24>140 AB25>67 AC24>62 AC25>66 AD1>G23 AD2>H20 AD3>H22 AD4>147 AD5>E21 AD6>D23 AD7>148 AD8>T22 AD9>V23 AD10>142 AD11>AA22 AD12>L20 AD13>143 AD14>P22 AD15>K23 AD16>144 AD17>P19 AD18>H23 AD19>145 AD20>D23 AD21>54 AD22>146 AD23>T22 AD24>77 AD25>65 AE1>149 AE2>G21 AE3>H23 AE4>G22 AE5>D21 AE6>D22 AE7>D20 AE8>T23 AE9>Y20 AE10>W20 AE11>Y21 AE12>M21 AE13>N21 AE14>P23 AE15>K22 AE16>L18 AE17>M23 AE18>H22 AE19>46 AE20>D22 AE21>57 AE22>60 AE23>T23 AE24>61 AE25>150 B4>151 B5>170 B12>B10 B14>B12 B15>F16 B16>86 C1>152 C2>E15 C3>A8 C4>154 C6>155 C8>F9 C10>153 C12>94 C13>C20 C15>84 C16>84 C17>88 C25>U6 D3>156 D6>157 D8>158 D13>A21 D14>E16 D16>86 D17>90 D24>V1 D25>Y1 E5>159 E6>160 E7>161 E8>215 E13>E19 E14>A20 E15>85 E17>93 E20>C14 E22>Y3 E23>W2 E24>V5 E25>V4 F5>162 F6>163 F7>164 F12>B20 F15>83 F16>89 F23>Y4 F24>AA3 F25>Y5 G3>168 G5>C16 G6>W23 G10>166 G11>279 G14>H14 G15>209 G17>237 G19>167 G20>W1 G21>V2 G22>W3 G23>AA1 G24>V7 G25>W7 H5>73 H6>70 H8>172 H9>277 H10>296 H11>259 H12>169 H13>244 H16>267 H17>287 H18>171 H19>W6 H20>V3 H21>W5 H22>P18 H23>AA4 H24>W8 H25>G20 J4>D14 J5>F18 J7>298 J8>177 J9>278 J10>297 J11>260 J12>173 J13>245 J14>238 J15>174 J16>268 J17>288 J18>175 J19>AA2 J21>V6 J22>AB3 J23>Y7 J24>V8 J25>J21 K7>D13 K8>182 K9>251 K10>178 K11>261 K12>179 K13>246 K14>239 K15>180 K16>269 K17>289 K18>181 K19>258 K20>AB4 K22>AA6 K23>AB5 K24>W9 K25>R21 L7>M7 L8>189 L9>252 L10>183 L11>262 L13>247 L14>240 L15>185 L16>270 L17>290 L18>186 L19>U9 L20>R22 L21>AA7 L22>F23 L23>V9 L24>T21 L25>C23 M8>194 M9>253 M10>190 M11>263 M12>191 M13>248 M14>241 M15>192 M16>271 M17>291 M18>193 M19>U9 M20>E20 M21>W10 M22>U20 M23>C22 M24>V10 M25>AB9 N7>B19 N8>198 N9>254 N10>195 N11>264 N12>294 N13>249 N14>242 N15>196 N16>272 N17>292 N18>197 N19>R2 N20>C2 N21>E4 N22>W11 N23>W21 N24>R23 N25>D3 P7>165 P8>203 P9>255 P10>199 P11>265 P12>200 P13>250 P14>243 P15>201 P16>273 P17>293 P18>202 P19>J7 P20>R6 P22>J4 P23>N4 P24>J5 P25>D2 R1>A3 R2>C6 R3>A4 R4>A5 R5>B5 R6>D8 R8>207 R9>256 R10>280 R11>266 R12>204 R13>250 R14>243 R15>205 R16>274 R17>206 R18>28 R19>E7 R21>G3 R22>G6 R23>R3 R24>H6 R25>R1 T1>B21 T2>E8 T3>A19 T4>W22 T5>C8 T6>E5 T8>213 T9>257 T10>281 T11>208 T13>282 T14>283 T15>210 T16>275 T17>211 T18>29 T19>212 T20>C1 T21>D1 T22>F3 T23>H5 T24>N3 T25>E2 U1>AB14 U2>AC14 U3>AB13 U4>AC13 U5>F6 U6>D6 U8>218 U10>284 U13>285 U14>286 U15>216 U18>30 U19>219 U20>D17 U21>K20 U22>F4 U23>G5 U24>F5 U25>F2 V1>AB12 V2>AC12 V3>Y13 V4>AA13 V5>E6 V6>B3 V8>220 V9>40 V10>31 V11>32 V12>33 V13>34 V14>35 V15>36 V16>37 V17>38 V18>39 V19>221 V23>A21 V24>E3 V25>U1 W1>Y12 W2>AA12 W3>222 W4>D18 W5>B21 W6>C4 W7>223 W8>224 W9>225 W10>226 W11>227 W15>230 W16>231 W17>232 W18>233 W19>234 W20>B17 W21>D15 W22>C19 W23>F12 W24>C3 W25>74 Y5>235 Y20>55 Y21>78 Y24>236 Y25>69